# Altium project KitKTS.PrjPcb (part 2 of 3)

## Sheet 08-NANDStatusLed.SchDoc
size A4
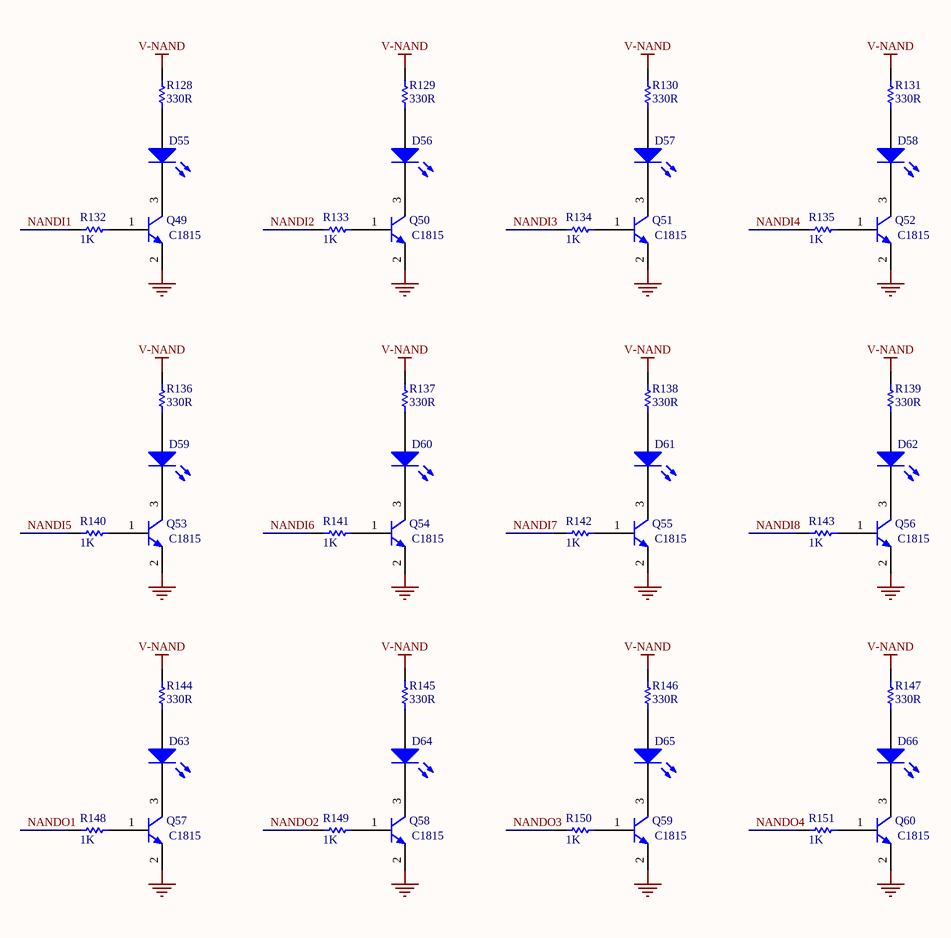
[diagram p13: 08-NANDStatusLed.SchDoc]

### Parts
D55  LED  [LED-3528]  (value not drawn)
D56  LED  [LED-3528]  (value not drawn)
D57  LED  [LED-3528]  (value not drawn)
D58  LED  [LED-3528]  (value not drawn)
D59  LED  [LED-3528]  (value not drawn)
D60  LED  [LED-3528]  (value not drawn)
D61  LED  [LED-3528]  (value not drawn)
D62  LED  [LED-3528]  (value not drawn)
D63  LED  [LED-3528]  (value not drawn)
D64  LED  [LED-3528]  (value not drawn)
D65  LED  [LED-3528]  (value not drawn)
D66  LED  [LED-3528]  (value not drawn)
Q49  value C1815  [SOT23-321]  (hidden comment: C1815-SMD)
Q50  value C1815  [SOT23-321]  (hidden comment: C1815-SMD)
Q51  value C1815  [SOT23-321]  (hidden comment: C1815-SMD)
Q52  value C1815  [SOT23-321]  (hidden comment: C1815-SMD)
Q53  value C1815  [SOT23-321]  (hidden comment: C1815-SMD)
Q54  value C1815  [SOT23-321]  (hidden comment: C1815-SMD)
Q55  value C1815  [SOT23-321]  (hidden comment: C1815-SMD)
Q56  value C1815  [SOT23-321]  (hidden comment: C1815-SMD)
Q57  value C1815  [SOT23-321]  (hidden comment: C1815-SMD)
Q58  value C1815  [SOT23-321]  (hidden comment: C1815-SMD)
Q59  value C1815  [SOT23-321]  (hidden comment: C1815-SMD)
Q60  value C1815  [SOT23-321]  (hidden comment: C1815-SMD)
R128  330R  [R-0805]
R129  330R  [R-0805]
R130  330R  [R-0805]
R131  330R  [R-0805]
R132  1K  [R-0805]
R133  1K  [R-0805]
R134  1K  [R-0805]
R135  1K  [R-0805]
R136  330R  [R-0805]
R137  330R  [R-0805]
R138  330R  [R-0805]
R139  330R  [R-0805]
R140  1K  [R-0805]
R141  1K  [R-0805]
R142  1K  [R-0805]
R143  1K  [R-0805]
R144  330R  [R-0805]
R145  330R  [R-0805]
R146  330R  [R-0805]
R147  330R  [R-0805]
R148  1K  [R-0805]
R149  1K  [R-0805]
R150  1K  [R-0805]
R151  1K  [R-0805]

### Nets
GND: Q49.2(E) Q50.2(E) Q51.2(E) Q52.2(E) Q53.2(E) Q54.2(E) Q55.2(E) Q56.2(E) Q57.2(E) Q58.2(E) Q59.2(E) Q60.2(E)
V-NAND: R128.2 R129.2 R130.2 R131.2 R136.2 R137.2 R138.2 R139.2 R144.2 R145.2 R146.2 R147.2
NANDI1: R132.2
NANDI2: R133.2
NANDI3: R134.2
NANDI4: R135.2
NANDI5: R140.2
NANDI6: R141.2
NANDI7: R142.2
NANDI8: R143.2
NANDO1: R148.2
NANDO2: R149.2
NANDO3: R150.2
NANDO4: R151.2
NetD55_1: D55.1(A) R128.1
NetD55_2: D55.2(K) Q49.3(C)
NetD56_1: D56.1(A) R129.1
NetD56_2: D56.2(K) Q50.3(C)
NetD57_1: D57.1(A) R130.1
NetD57_2: D57.2(K) Q51.3(C)
NetD58_1: D58.1(A) R131.1
NetD58_2: D58.2(K) Q52.3(C)
NetD59_1: D59.1(A) R136.1
NetD59_2: D59.2(K) Q53.3(C)
NetD60_1: D60.1(A) R137.1
NetD60_2: D60.2(K) Q54.3(C)
NetD61_1: D61.1(A) R138.1
NetD61_2: D61.2(K) Q55.3(C)
NetD62_1: D62.1(A) R139.1
NetD62_2: D62.2(K) Q56.3(C)
NetD63_1: D63.1(A) R144.1
NetD63_2: D63.2(K) Q57.3(C)
NetD64_1: D64.1(A) R145.1
NetD64_2: D64.2(K) Q58.3(C)
NetD65_1: D65.1(A) R146.1
NetD65_2: D65.2(K) Q59.3(C)
NetD66_1: D66.1(A) R147.1
NetD66_2: D66.2(K) Q60.3(C)
NetQ49_1: Q49.1(B) R132.1
NetQ50_1: Q50.1(B) R133.1
NetQ51_1: Q51.1(B) R134.1
NetQ52_1: Q52.1(B) R135.1
NetQ53_1: Q53.1(B) R140.1
NetQ54_1: Q54.1(B) R141.1
NetQ55_1: Q55.1(B) R142.1
NetQ56_1: Q56.1(B) R143.1
NetQ57_1: Q57.1(B) R148.1
NetQ58_1: Q58.1(B) R149.1
NetQ59_1: Q59.1(B) R150.1
NetQ60_1: Q60.1(B) R151.1

### Library data of the parts
D55-D66 = LED2: as D7 on sheet 04-ANDStatusLed; Published: 8-Jun-2000; LatestRevisionDate: 17-Jul-2002; LatestRevisionNote: Re-released for DXP Platform.; PackageVersion: Feb-2002; PackageReference: 3.2X1.6X1.1; Publisher: Altium Limited; PackageDescription: SM LED; 2 Flat Leads
Q49-Q60 = NPN: NPN Bipolar Transistor; Published: 8-Jun-2000; LatestRevisionDate: 17-Jul-2002; LatestRevisionNote: Re-released for DXP Platform.; PackageReference: TO-226-AA; PackageDescription: TO, Flat Index; 3 In-Line, Axial Leads; Body Dia. 4.8mm; Leads 0.55 x 0.51 mm (max); Code_JEDEC: TO-226-AA
R128-R151 = Res1: Resistor; Published: 8-Jun-2000; LatestRevisionDate: 17-Jul-2002; LatestRevisionNote: Re-released for DXP Platform.; PackageReference: AXIAL-0.3; Publisher: Altium Limited; PackageDescription: Axial Device, Thru-Hole; 2 Leads; 0.3 in Pin Spacing
  R128-R131 R136-R139 R144-R147: Value: 330R
  R132-R135 R140-R143 R148-R151: Value: 1K

## Sheet 09-LogicNOR.SchDoc
size A4
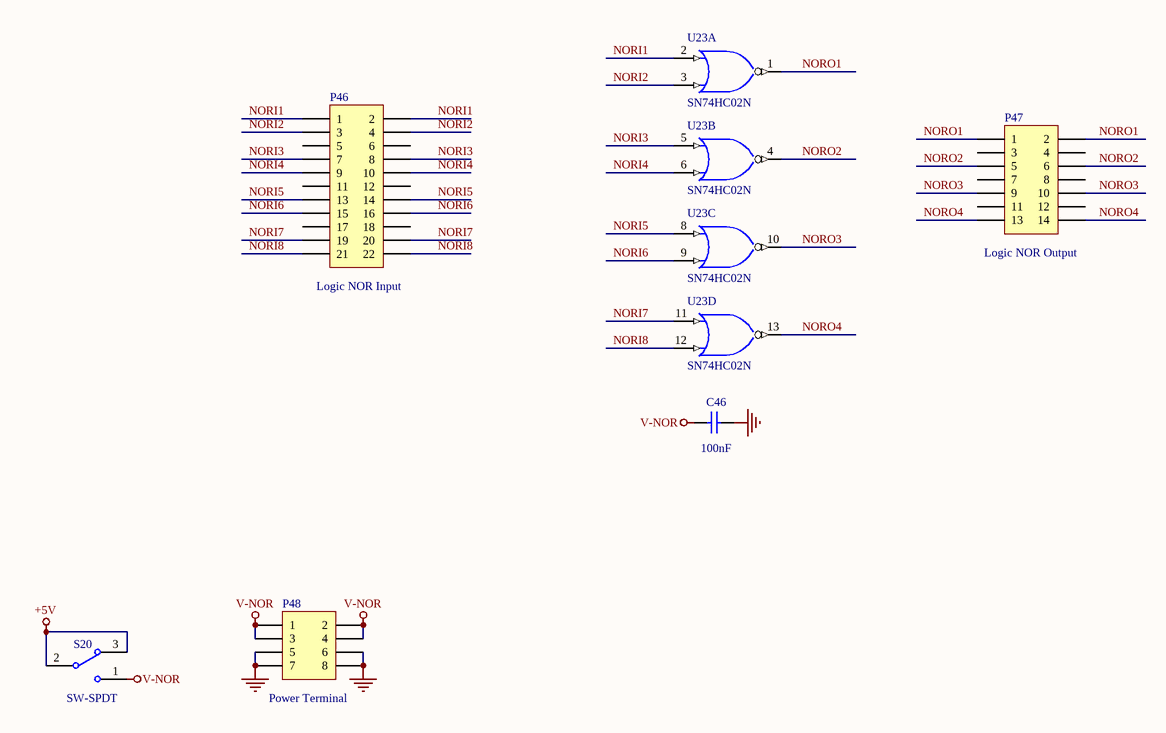
[diagram p14: 09-LogicNOR.SchDoc]

### Parts
C46  value 100nF  [C-0805]  (hidden comment: 104)
P46  value Logic NOR Input  [HDR2X11]  (hidden comment: Header 11X2)
P47  value Logic NOR Output  [HDR2X7]  (hidden comment: H7X2)
P48  Publisher: Power Terminal  [HDR2X4]  (hidden comment: Header 4X2)
S20  SW-SPDT  [SW-DIP1SMD]
U23  SN74HC02N  [SK-DIP14-300]  (parts A,B,C,D of 4)

### Nets
+5V: S20.2 S20.3
GND: C46.2 P48.5 P48.6 P48.7 P48.8 U23.7(GND)
V-NOR: C46.1 P48.1 P48.2 P48.3 P48.4 S20.1
VCC: U23.14(V-NOR)
NORI1: P46.1 P46.2 U23.2(A)
NORI2: P46.3 P46.4 U23.3(B)
NORI3: P46.7 P46.8 U23.5(A)
NORI4: P46.9 P46.10 U23.6(B)
NORI5: P46.13 P46.14 U23.8(A)
NORI6: P46.15 P46.16 U23.9(B)
NORI7: P46.19 P46.20 U23.11(A)
NORI8: P46.21 P46.22 U23.12(B)
NORO1: P47.1 P47.2 U23.1(Y)
NORO2: P47.5 P47.6 U23.4(Y)
NORO3: P47.9 P47.10 U23.10(Y)
NORO4: P47.13 P47.14 U23.13(Y)

Not connected (* = marked no-connect by the designer): P46 5 6 11 12 17 18; P47 3 4 7 8 11 12

### Library data of the parts
C46 = Cap: Capacitor; Published: 8-Jun-2000; LatestRevisionDate: 17-Jul-2002; LatestRevisionNote: Re-released for DXP Platform.; PackageReference: RAD-0.3; Publisher: Altium Limited; PackageDescription: Radial Cap, Thru-Hole; 2 Leads; 0.3 in Pin Spacing
P46 = Header 11X2: Header, 11-Pin, Dual row; LatestRevisionDate: 17-Jul-2002; LatestRevisionNote: Re-released for DXP Platform.
P47 = Header 7X2: Header, 7-Pin, Dual row; LatestRevisionDate: 17-Jul-2002; LatestRevisionNote: Re-released for DXP Platform.
P48 = Header 4X2: Header, 4-Pin, Dual row; LatestRevisionDate: 17-Jul-2002; LatestRevisionNote: Re-released for DXP Platform.
S20 = SW-SPDT: as S10 on sheet 02-PowerSupply; Published: 24-Mar-1999; LatestRevisionDate: 17-Dec-2003; LatestRevisionNote: Schematic revised, PCB Footprint replaced.; DatasheetVersion: 05-Dec-2000; PackageReference: TL36WW15050; Publisher: Altium Limited; PackageDescription: Switch; 4 Leads; ComponentLink1Description: Manufacturer Link; ComponentLink1URL: http://www.apem.com
U23 = SN74HC02N: Quadruple 2-Input Positive-NOR Gate; Published: 8-Jun-2000; LatestRevisionDate: 04-Mar-2005; LatestRevisionNote: Stylized 3D Model Added.; DatasheetVersion: May-1997; PackageVersion: Oct-1995; PackageReference: N014; Publisher: Altium Limited; PackageDescription: DIP; 14 Leads; Row Spacing 7.62 mm; Pitch 2.54 mm; ComponentLink1Description: Manufacturer Link; ComponentLink1URL: http://www.ti.com/; ComponentLink2Description: Datasheet; ComponentLink2URL: http://www-s.ti.com/sc/ds/sn74hc02.pdf

## Sheet 09-NORStatusLed.SchDoc
size A4
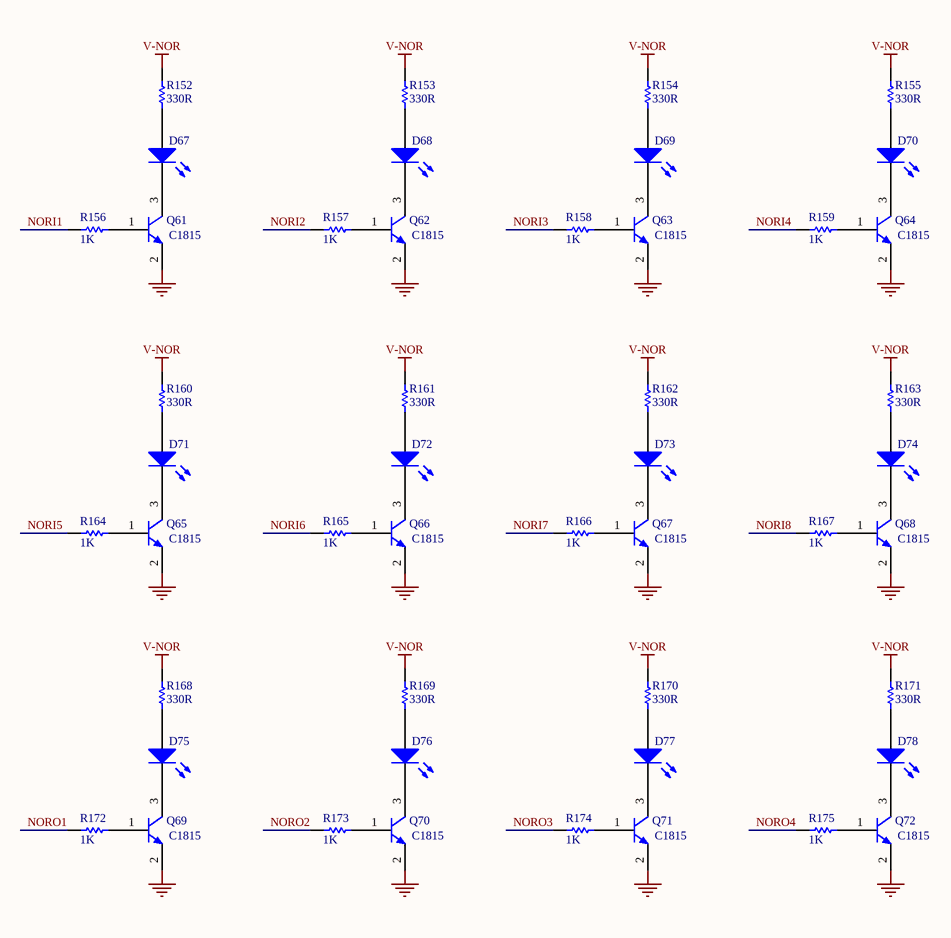
[diagram p15: 09-NORStatusLed.SchDoc]

### Parts
D67  LED  [LED-3528]  (value not drawn)
D68  LED  [LED-3528]  (value not drawn)
D69  LED  [LED-3528]  (value not drawn)
D70  LED  [LED-3528]  (value not drawn)
D71  LED  [LED-3528]  (value not drawn)
D72  LED  [LED-3528]  (value not drawn)
D73  LED  [LED-3528]  (value not drawn)
D74  LED  [LED-3528]  (value not drawn)
D75  LED  [LED-3528]  (value not drawn)
D76  LED  [LED-3528]  (value not drawn)
D77  LED  [LED-3528]  (value not drawn)
D78  LED  [LED-3528]  (value not drawn)
Q61  value C1815  [SOT23-321]  (hidden comment: C1815-SMD)
Q62  value C1815  [SOT23-321]  (hidden comment: C1815-SMD)
Q63  value C1815  [SOT23-321]  (hidden comment: C1815-SMD)
Q64  value C1815  [SOT23-321]  (hidden comment: C1815-SMD)
Q65  value C1815  [SOT23-321]  (hidden comment: C1815-SMD)
Q66  value C1815  [SOT23-321]  (hidden comment: C1815-SMD)
Q67  value C1815  [SOT23-321]  (hidden comment: C1815-SMD)
Q68  value C1815  [SOT23-321]  (hidden comment: C1815-SMD)
Q69  value C1815  [SOT23-321]  (hidden comment: C1815-SMD)
Q70  value C1815  [SOT23-321]  (hidden comment: C1815-SMD)
Q71  value C1815  [SOT23-321]  (hidden comment: C1815-SMD)
Q72  value C1815  [SOT23-321]  (hidden comment: C1815-SMD)
R152  330R  [R-0805]
R153  330R  [R-0805]
R154  330R  [R-0805]
R155  330R  [R-0805]
R156  1K  [R-0805]
R157  1K  [R-0805]
R158  1K  [R-0805]
R159  1K  [R-0805]
R160  330R  [R-0805]
R161  330R  [R-0805]
R162  330R  [R-0805]
R163  330R  [R-0805]
R164  1K  [R-0805]
R165  1K  [R-0805]
R166  1K  [R-0805]
R167  1K  [R-0805]
R168  330R  [R-0805]
R169  330R  [R-0805]
R170  330R  [R-0805]
R171  330R  [R-0805]
R172  1K  [R-0805]
R173  1K  [R-0805]
R174  1K  [R-0805]
R175  1K  [R-0805]

### Nets
GND: Q61.2(E) Q62.2(E) Q63.2(E) Q64.2(E) Q65.2(E) Q66.2(E) Q67.2(E) Q68.2(E) Q69.2(E) Q70.2(E) Q71.2(E) Q72.2(E)
V-NOR: R152.2 R153.2 R154.2 R155.2 R160.2 R161.2 R162.2 R163.2 R168.2 R169.2 R170.2 R171.2
NORI1: R156.2
NORI2: R157.2
NORI3: R158.2
NORI4: R159.2
NORI5: R164.2
NORI6: R165.2
NORI7: R166.2
NORI8: R167.2
NORO1: R172.2
NORO2: R173.2
NORO3: R174.2
NORO4: R175.2
NetD67_1: D67.1(A) R152.1
NetD67_2: D67.2(K) Q61.3(C)
NetD68_1: D68.1(A) R153.1
NetD68_2: D68.2(K) Q62.3(C)
NetD69_1: D69.1(A) R154.1
NetD69_2: D69.2(K) Q63.3(C)
NetD70_1: D70.1(A) R155.1
NetD70_2: D70.2(K) Q64.3(C)
NetD71_1: D71.1(A) R160.1
NetD71_2: D71.2(K) Q65.3(C)
NetD72_1: D72.1(A) R161.1
NetD72_2: D72.2(K) Q66.3(C)
NetD73_1: D73.1(A) R162.1
NetD73_2: D73.2(K) Q67.3(C)
NetD74_1: D74.1(A) R163.1
NetD74_2: D74.2(K) Q68.3(C)
NetD75_1: D75.1(A) R168.1
NetD75_2: D75.2(K) Q69.3(C)
NetD76_1: D76.1(A) R169.1
NetD76_2: D76.2(K) Q70.3(C)
NetD77_1: D77.1(A) R170.1
NetD77_2: D77.2(K) Q71.3(C)
NetD78_1: D78.1(A) R171.1
NetD78_2: D78.2(K) Q72.3(C)
NetQ61_1: Q61.1(B) R156.1
NetQ62_1: Q62.1(B) R157.1
NetQ63_1: Q63.1(B) R158.1
NetQ64_1: Q64.1(B) R159.1
NetQ65_1: Q65.1(B) R164.1
NetQ66_1: Q66.1(B) R165.1
NetQ67_1: Q67.1(B) R166.1
NetQ68_1: Q68.1(B) R167.1
NetQ69_1: Q69.1(B) R172.1
NetQ70_1: Q70.1(B) R173.1
NetQ71_1: Q71.1(B) R174.1
NetQ72_1: Q72.1(B) R175.1

### Library data of the parts
D67-D78 = LED2: as D7 on sheet 04-ANDStatusLed; Published: 8-Jun-2000; LatestRevisionDate: 17-Jul-2002; LatestRevisionNote: Re-released for DXP Platform.; PackageVersion: Feb-2002; PackageReference: 3.2X1.6X1.1; Publisher: Altium Limited; PackageDescription: SM LED; 2 Flat Leads
Q61-Q72 = NPN: NPN Bipolar Transistor; Published: 8-Jun-2000; LatestRevisionDate: 17-Jul-2002; LatestRevisionNote: Re-released for DXP Platform.; PackageReference: TO-226-AA; PackageDescription: TO, Flat Index; 3 In-Line, Axial Leads; Body Dia. 4.8mm; Leads 0.55 x 0.51 mm (max); Code_JEDEC: TO-226-AA
R152-R175 = Res1: Resistor; Published: 8-Jun-2000; LatestRevisionDate: 17-Jul-2002; LatestRevisionNote: Re-released for DXP Platform.; PackageReference: AXIAL-0.3; Publisher: Altium Limited; PackageDescription: Axial Device, Thru-Hole; 2 Leads; 0.3 in Pin Spacing
  R152-R155 R160-R163 R168-R171: Value: 330R
  R156-R159 R164-R167 R172-R175: Value: 1K

## Sheet 10-Buffer.SchDoc
size A4
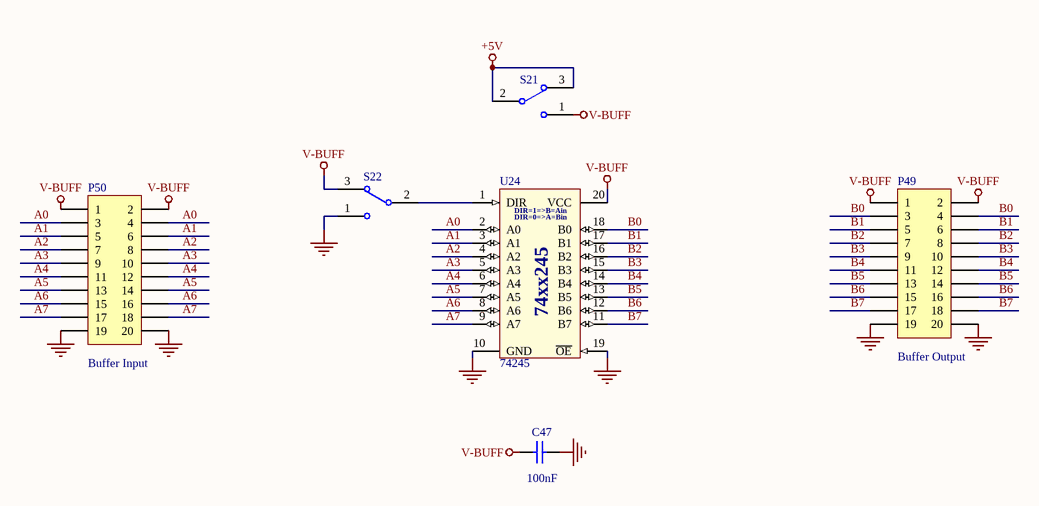
[diagram p16: 10-Buffer.SchDoc]

### Parts
C47  value 100nF  [C-0805]  (hidden comment: 104)
P49  value Buffer Output  [HDR2X10]  (hidden comment: H10X2)
P50  value Buffer Input  [HDR2X10]  (hidden comment: H10X2)
S21  SW-SPDT  [SW-DIP1SMD]  (value not drawn)
S22  SW-SPDT  [SW-DIP1SMD]  (value not drawn)
U24  74245  [DIP20/W0.3]

### Nets
+5V: S21.2 S21.3
GND: C47.2 P49.19 P49.20 P50.19 P50.20 S22.1 U24.10(GND) U24.19(~{OE})
V-BUFF: C47.1 P49.1 P49.2 P50.1 P50.2 S21.1 S22.3 U24.20(VCC)
A0: P50.3 P50.4 U24.2(A0)
A1: P50.5 P50.6 U24.3(A1)
A2: P50.7 P50.8 U24.4(A2)
A3: P50.9 P50.10 U24.5(A3)
A4: P50.11 P50.12 U24.6(A4)
A5: P50.13 P50.14 U24.7(A5)
A6: P50.15 P50.16 U24.8(A6)
A7: P50.17 P50.18 U24.9(A7)
B0: P49.3 P49.4 U24.18(B0)
B1: P49.5 P49.6 U24.17(B1)
B2: P49.7 P49.8 U24.16(B2)
B3: P49.9 P49.10 U24.15(B3)
B4: P49.11 P49.12 U24.14(B4)
B5: P49.13 P49.14 U24.13(B5)
B6: P49.15 P49.16 U24.12(B6)
B7: P49.17 P49.18 U24.11(B7)
NetS22_2: S22.2 U24.1(DIR)

### Notes on the sheet
- (in symbol 74245) DIR=1=>B=Ain; DIR=0=>A=Bin; 74xx245

### Library data of the parts
C47 = Cap: Capacitor; Published: 8-Jun-2000; LatestRevisionDate: 17-Jul-2002; LatestRevisionNote: Re-released for DXP Platform.; PackageReference: RAD-0.3; Publisher: Altium Limited; PackageDescription: Radial Cap, Thru-Hole; 2 Leads; 0.3 in Pin Spacing
P49 P50 = Header 10X2: Header, 10-Pin, Dual row; LatestRevisionDate: 17-Jul-2002; LatestRevisionNote: Re-released for DXP Platform.
S21 S22 = SW-SPDT: as S10 on sheet 02-PowerSupply; Published: 24-Mar-1999; LatestRevisionDate: 17-Dec-2003; LatestRevisionNote: Schematic revised, PCB Footprint replaced.; DatasheetVersion: 05-Dec-2000; PackageReference: TL36WW15050; Publisher: Altium Limited; PackageDescription: Switch; 4 Leads; ComponentLink1Description: Manufacturer Link; ComponentLink1URL: http://www.apem.com
U24 = 74245: Octal bus tranceiver; 3-state; Copyright by: VanDungEvn@gmail.com

## Sheet 11-DFlipFlop.SchDoc
size A4
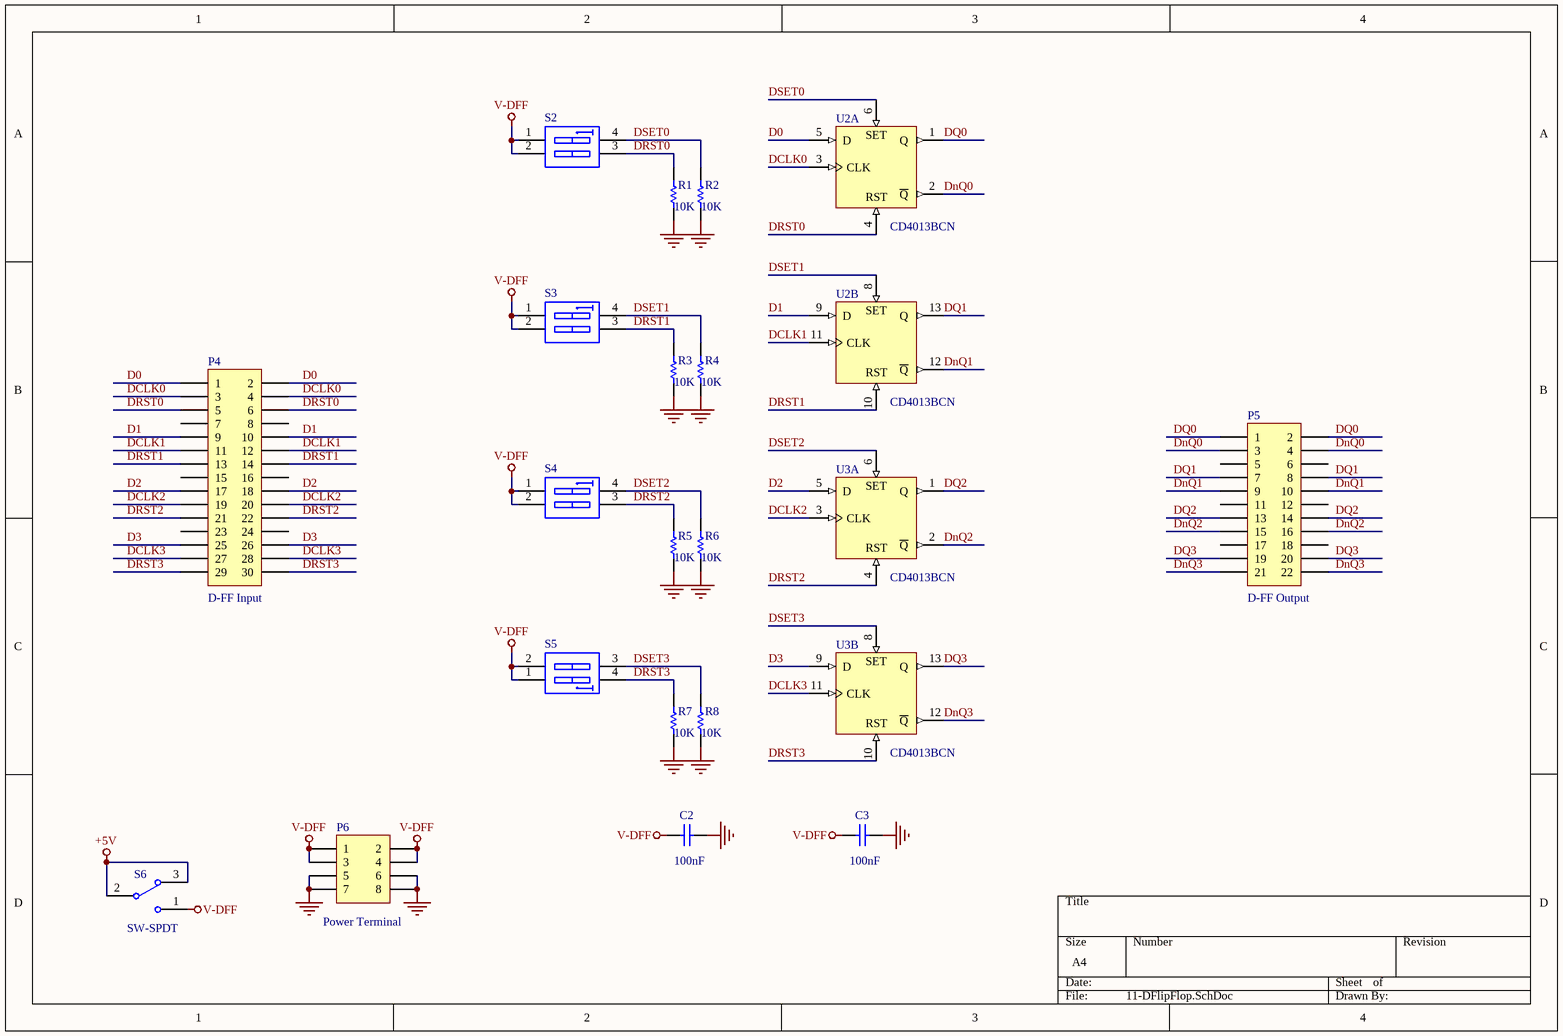
[diagram p17: 11-DFlipFlop.SchDoc]

### Parts
C2  value 100nF  [C-0805]  (hidden comment: 104)
C3  value 100nF  [C-0805]  (hidden comment: 104)
P4  value D-FF Input  [HDR2X15]  (hidden comment: Header 15X2)
P5  value D-FF Output  [HDR2X11]  (hidden comment: Header 11X2)
P6  Publisher: Power Terminal  [HDR2X4]  (hidden comment: Header 4X2)
R1  10K  [r-0805]
R2  10K  [r-0805]
R3  10K  [r-0805]
R4  10K  [r-0805]
R5  10K  [r-0805]
R6  10K  [r-0805]
R7  10K  [r-0805]
R8  10K  [r-0805]
S2  SW DIP-2  [sw-dip2]  (value not drawn)
S3  SW DIP-2  [sw-dip2]  (value not drawn)
S4  SW DIP-2  [sw-dip2]  (value not drawn)
S5  SW DIP-2  [sw-dip2]  (value not drawn)
S6  SW-SPDT  [SW-DIP1SMD]
U2  CD4013BCN  [SK-DIP14-300]  (parts A,B of 2)
U3  CD4013BCN  [SK-DIP14-300]  (parts A,B of 2)

### Nets
+5V: S6.2 S6.3
GND: C2.2 C3.2 P6.5 P6.6 P6.7 P6.8 R1.1 R2.1 R3.1 R4.1 R5.1 R6.1 R7.1 R8.1 U2.7(GND) U3.7(GND)
V-DFF: C2.1 C3.1 P6.1 P6.2 P6.3 P6.4 S2.1(A1) S2.2(A2) S3.1(A1) S3.2(A2) S4.1(A1) S4.2(A2) S5.1(A1) S5.2(A2) S6.1
VDD: U2.14(V-DFF) U3.14(V-DFF)
D0: P4.1 P4.2 U2.5(D)
D1: P4.9 P4.10 U2.9(D)
D2: P4.17 P4.18 U3.5(D)
D3: P4.25 P4.26 U3.9(D)
DCLK0: P4.3 P4.4 U2.3(CLK)
DCLK1: P4.11 P4.12 U2.11(CLK)
DCLK2: P4.19 P4.20 U3.3(CLK)
DCLK3: P4.27 P4.28 U3.11(CLK)
DnQ0: P5.3 P5.4 U2.2(~{Q})
DnQ1: P5.9 P5.10 U2.12(~{Q})
DnQ2: P5.15 P5.16 U3.2(~{Q})
DnQ3: P5.21 P5.22 U3.12(~{Q})
DQ0: P5.1 P5.2 U2.1(Q)
DQ1: P5.7 P5.8 U2.13(Q)
DQ2: P5.13 P5.14 U3.1(Q)
DQ3: P5.19 P5.20 U3.13(Q)
DRST0: P4.5 P4.6 R1.2 S2.3(B2) U2.4(RST)
DRST1: P4.13 P4.14 R3.2 S3.3(B2) U2.10(RST)
DRST2: P4.21 P4.22 R5.2 S4.3(B2) U3.4(RST)
DRST3: P4.29 P4.30 R7.2 S5.4(B1) U3.10(RST)
DSET0: R2.2 S2.4(B1) U2.6(S)
DSET1: R4.2 S3.4(B1) U2.8(S)
DSET2: R6.2 S4.4(B1) U3.6(S)
DSET3: R8.2 S5.3(B2) U3.8(S)

Not connected (* = marked no-connect by the designer): P4 7 8 15 16 23 24; P5 5 6 11 12 17 18

### Notes on the sheet
- (in symbol CD4013BCN, part A) SET
- (in symbol CD4013BCN, part B) SET

### Library data of the parts
C2 C3 = Cap: Capacitor; Published: 8-Jun-2000; LatestRevisionDate: 17-Jul-2002; LatestRevisionNote: Re-released for DXP Platform.; PackageReference: RAD-0.3; Publisher: Altium Limited; PackageDescription: Radial Cap, Thru-Hole; 2 Leads; 0.3 in Pin Spacing
P4 = Header 15X2: Header, 15-Pin, Dual row; LatestRevisionDate: 17-Jul-2002; LatestRevisionNote: Re-released for DXP Platform.
P5 = Header 11X2: Header, 11-Pin, Dual row; LatestRevisionDate: 17-Jul-2002; LatestRevisionNote: Re-released for DXP Platform.
P6 = Header 4X2: Header, 4-Pin, Dual row; LatestRevisionDate: 17-Jul-2002; LatestRevisionNote: Re-released for DXP Platform.
R1-R8 = Res1: Resistor; Published: 8-Jun-2000; LatestRevisionDate: 17-Jul-2002; LatestRevisionNote: Re-released for DXP Platform.; PackageReference: AXIAL-0.3; Publisher: Altium Limited; PackageDescription: Axial Device, Thru-Hole; 2 Leads; 0.3 in Pin Spacing; Value: 10K
S2-S5 = SW DIP-2: DIP Switch, 2 Position, SPST; Published: 24-Mar-1999; LatestRevisionDate: 17-Jul-2002; LatestRevisionNote: Re-released for DXP Platform.; PackageReference: DIP-4; Publisher: Altium Limited
S6 = SW-SPDT: as S10 on sheet 02-PowerSupply; Published: 24-Mar-1999; LatestRevisionDate: 17-Dec-2003; LatestRevisionNote: Schematic revised, PCB Footprint replaced.; DatasheetVersion: 05-Dec-2000; PackageReference: TL36WW15050; Publisher: Altium Limited; PackageDescription: Switch; 4 Leads; ComponentLink1Description: Manufacturer Link; ComponentLink1URL: http://www.apem.com
U2 U3 = CD4013BCN: Dual D-Type Flip-Flop; Published: 17-Jul-2002; LatestRevisionDate: 29-May-2009; LatestRevisionNote: Component Body Added.; DatasheetVersion: Jan-1999; PackageVersion: 2000; PackageReference: N14A; Publisher: Altium Limited; PackageDescription: DIP, 14-Pin, Row Spacing 7.62 mm, Pitch 2.54 mm; ComponentLink1Description: Manufacturer Link; ComponentLink1URL: http://www.fairchildsemi.com/

## Sheet 12-JKFlipFlop.SchDoc
size A4
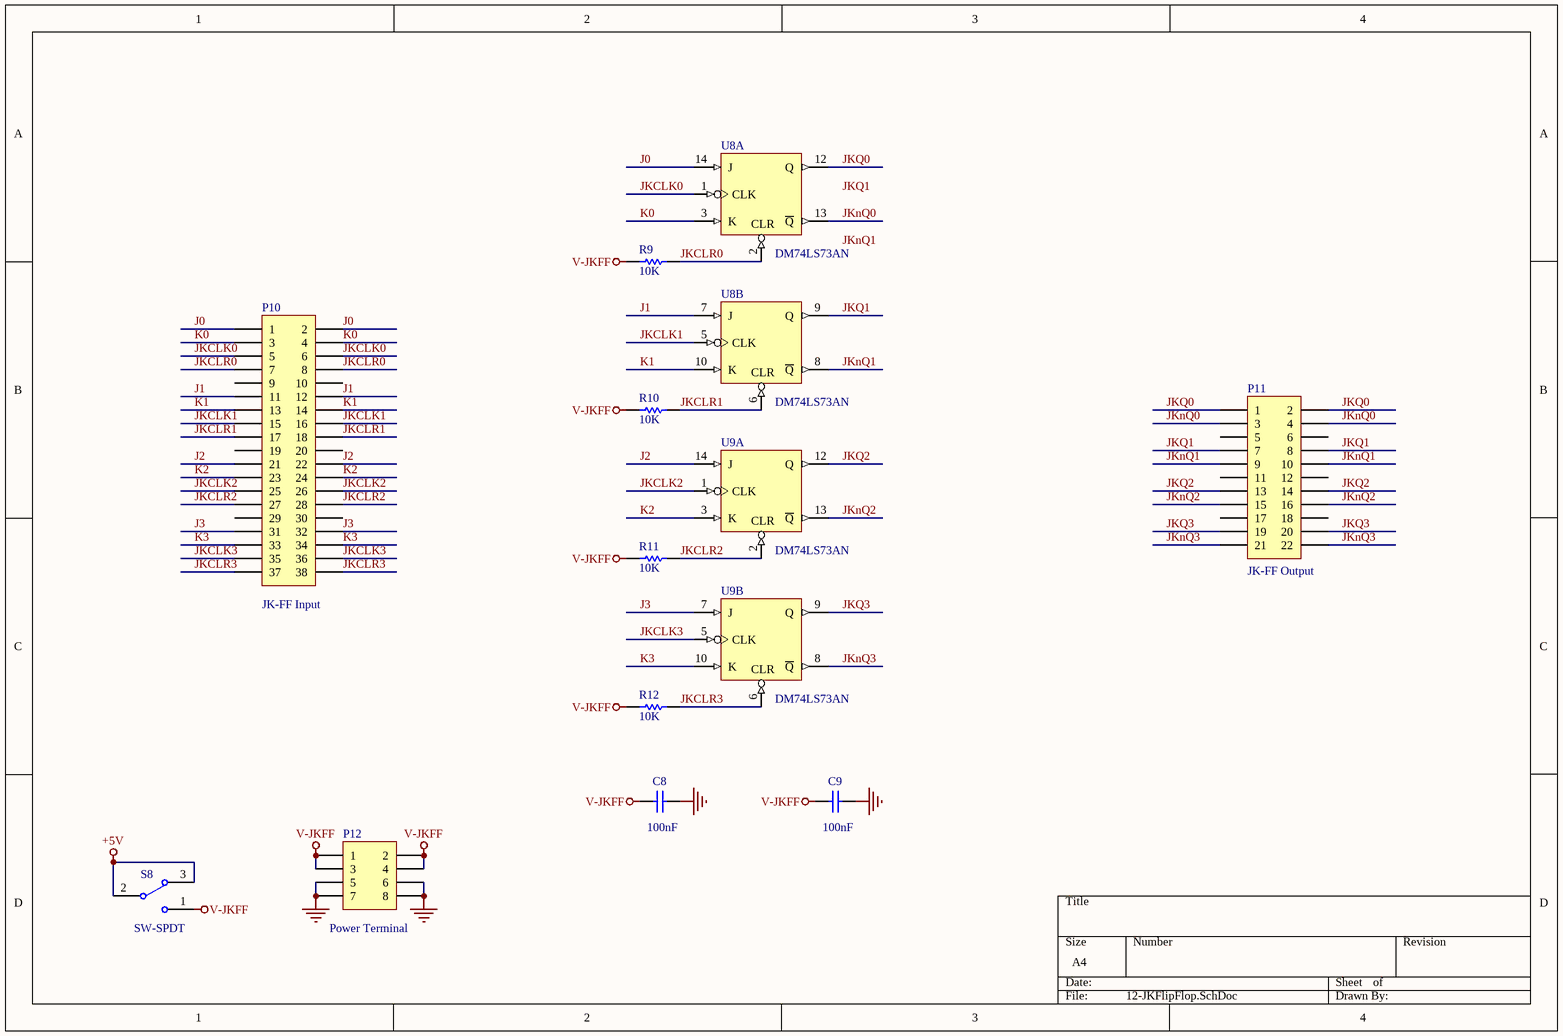
[diagram p18: 12-JKFlipFlop.SchDoc]

### Parts
C8  value 100nF  [c-0805]  (hidden comment: 104)
C9  value 100nF  [c-0805]  (hidden comment: 104)
P10  value JK-FF Input  [HDR2X19]  (hidden comment: Header 19X2)
P11  value JK-FF Output  [HDR2X11]  (hidden comment: Header 11X2)
P12  Publisher: Power Terminal  [HDR2X4]  (hidden comment: Header 4X2)
R9  10K  [r-0805]
R10  10K  [r-0805]
R11  10K  [r-0805]
R12  10K  [r-0805]
S8  SW-SPDT  [SW-DIP1SMD]
U8  DM74LS73AN  [SK-DIP14-300]  (parts A,B of 2)
U9  DM74LS73AN  [SK-DIP14-300]  (parts A,B of 2)

### Nets
+5V: S8.2 S8.3
GND: C8.2 C9.2 P12.5 P12.6 P12.7 P12.8 U8.11(GND) U9.11(GND)
V-JKFF: C8.1 C9.1 P12.1 P12.2 P12.3 P12.4 R9.2 R10.2 R11.2 R12.2 S8.1
VCC: U8.4(V-JKFF) U9.4(V-JKFF)
J0: P10.1 P10.2 U8.14(J)
J1: P10.11 P10.12 U8.7(J)
J2: P10.21 P10.22 U9.14(J)
J3: P10.31 P10.32 U9.7(J)
JKCLK0: P10.5 P10.6 U8.1(CLK)
JKCLK1: P10.15 P10.16 U8.5(CLK)
JKCLK2: P10.25 P10.26 U9.1(CLK)
JKCLK3: P10.35 P10.36 U9.5(CLK)
JKCLR0: P10.7 P10.8 R9.1 U8.2(CLR)
JKCLR1: P10.17 P10.18 R10.1 U8.6(CLR)
JKCLR2: P10.27 P10.28 R11.1 U9.2(CLR)
JKCLR3: P10.37 P10.38 R12.1 U9.6(CLR)
JKnQ0: P11.3 P11.4 U8.13(~{Q})
JKnQ1: P11.9 P11.10 U8.8(~{Q})
JKnQ2: P11.15 P11.16 U9.13(~{Q})
JKnQ3: P11.21 P11.22 U9.8(~{Q})
JKQ0: P11.1 P11.2 U8.12(Q)
JKQ1: P11.7 P11.8 U8.9(Q)
JKQ2: P11.13 P11.14 U9.12(Q)
JKQ3: P11.19 P11.20 U9.9(Q)
K0: P10.3 P10.4 U8.3(K)
K1: P10.13 P10.14 U8.10(K)
K2: P10.23 P10.24 U9.3(K)
K3: P10.33 P10.34 U9.10(K)

Not connected (* = marked no-connect by the designer): P10 9 10 19 20 29 30; P11 5 6 11 12 17 18

### Notes on the sheet
- Labels drawn without touching a wire or pin: JKnQ1, JKQ1

### Library data of the parts
C8 C9 = Cap: Capacitor; Published: 8-Jun-2000; LatestRevisionDate: 17-Jul-2002; LatestRevisionNote: Re-released for DXP Platform.; PackageReference: RAD-0.3; Publisher: Altium Limited; PackageDescription: Radial Cap, Thru-Hole; 2 Leads; 0.3 in Pin Spacing
P10 = Header 19X2: Header, 19-Pin, Dual row; LatestRevisionDate: 17-Jul-2002; LatestRevisionNote: Re-released for DXP Platform.
P11 = Header 11X2: Header, 11-Pin, Dual row; LatestRevisionDate: 17-Jul-2002; LatestRevisionNote: Re-released for DXP Platform.
P12 = Header 4X2: Header, 4-Pin, Dual row; LatestRevisionDate: 17-Jul-2002; LatestRevisionNote: Re-released for DXP Platform.
R9-R12 = Res1: Resistor; Published: 8-Jun-2000; LatestRevisionDate: 17-Jul-2002; LatestRevisionNote: Re-released for DXP Platform.; PackageReference: AXIAL-0.3; Publisher: Altium Limited; PackageDescription: Axial Device, Thru-Hole; 2 Leads; 0.3 in Pin Spacing; Value: 10K
S8 = SW-SPDT: as S10 on sheet 02-PowerSupply; Published: 24-Mar-1999; LatestRevisionDate: 17-Dec-2003; LatestRevisionNote: Schematic revised, PCB Footprint replaced.; DatasheetVersion: 05-Dec-2000; PackageReference: TL36WW15050; Publisher: Altium Limited; PackageDescription: Switch; 4 Leads; ComponentLink1Description: Manufacturer Link; ComponentLink1URL: http://www.apem.com
U8 U9 = DM74LS73AN: Dual Negative-Edge-Triggered Master-Slave J-K Flip-Flop with Clear and Complementary Output; Published: 17-Jul-2002; LatestRevisionDate: 29-May-2009; LatestRevisionNote: Component Body Added.; DatasheetVersion: Mar-1998; PackageVersion: 2000; PackageReference: N14A; Publisher: Altium Limited; PackageDescription: DIP, 14-Pin, Row Spacing 7.62 mm, Pitch 2.54 mm; ComponentLink1Description: Manufacturer Link; ComponentLink1URL: http://www.fairchildsemi.com/

## Sheet 13-Counter74LS90.SchDoc
size A4
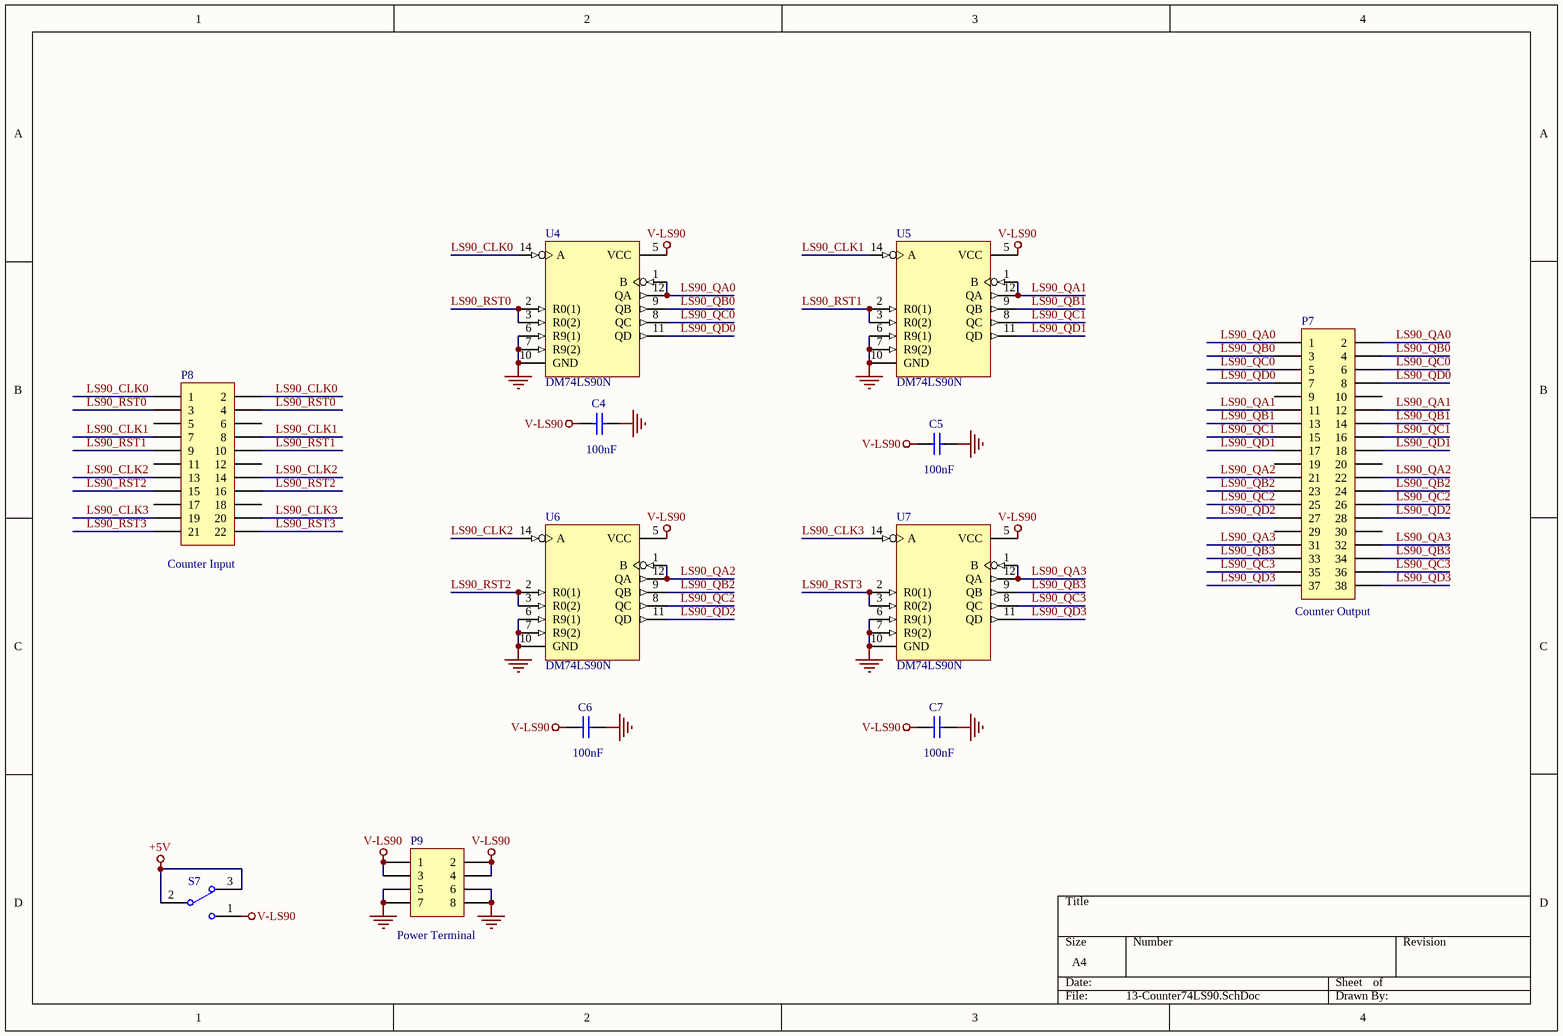
[diagram p19: 13-Counter74LS90.SchDoc]

### Parts
C4  value 100nF  [c-0805]  (hidden comment: 104)
C5  value 100nF  [c-0805]  (hidden comment: 104)
C6  value 100nF  [c-0805]  (hidden comment: 104)
C7  value 100nF  [c-0805]  (hidden comment: 104)
P7  value Counter Output  [HDR2X19]  (hidden comment: Header 19X2)
P8  value Counter Input  [HDR2X11]  (hidden comment: Header 11X2)
P9  Publisher: Power Terminal  [HDR2X4]  (hidden comment: Header 4X2)
S7  SW-SPDT  [SW-DIP1SMD]  (value not drawn)
U4  DM74LS90N  [SK-DIP14-300]
U5  DM74LS90N  [SK-DIP14-300]
U6  DM74LS90N  [SK-DIP14-300]
U7  DM74LS90N  [SK-DIP14-300]

### Nets
+5V: S7.2 S7.3
GND: C4.2 C5.2 C6.2 C7.2 P9.5 P9.6 P9.7 P9.8 U4.6(R9(1)) U4.7(R9(2)) U4.10(GND) U5.6(R9(1)) U5.7(R9(2)) U5.10(GND) U6.6(R9(1)) U6.7(R9(2)) U6.10(GND) U7.6(R9(1)) U7.7(R9(2)) U7.10(GND)
V-LS90: C4.1 C5.1 C6.1 C7.1 P9.1 P9.2 P9.3 P9.4 S7.1 U4.5(VCC) U5.5(VCC) U6.5(VCC) U7.5(VCC)
LS90_CLK0: P8.1 P8.2 U4.14(A)
LS90_CLK1: P8.7 P8.8 U5.14(A)
LS90_CLK2: P8.13 P8.14 U6.14(A)
LS90_CLK3: P8.19 P8.20 U7.14(A)
LS90_QA0: P7.1 P7.2 U4.1(B) U4.12(QA)
LS90_QA1: P7.11 P7.12 U5.1(B) U5.12(QA)
LS90_QA2: P7.21 P7.22 U6.1(B) U6.12(QA)
LS90_QA3: P7.31 P7.32 U7.1(B) U7.12(QA)
LS90_QB0: P7.3 P7.4 U4.9(QB)
LS90_QB1: P7.13 P7.14 U5.9(QB)
LS90_QB2: P7.23 P7.24 U6.9(QB)
LS90_QB3: P7.33 P7.34 U7.9(QB)
LS90_QC0: P7.5 P7.6 U4.8(QC)
LS90_QC1: P7.15 P7.16 U5.8(QC)
LS90_QC2: P7.25 P7.26 U6.8(QC)
LS90_QC3: P7.35 P7.36 U7.8(QC)
LS90_QD0: P7.7 P7.8 U4.11(QD)
LS90_QD1: P7.17 P7.18 U5.11(QD)
LS90_QD2: P7.27 P7.28 U6.11(QD)
LS90_QD3: P7.37 P7.38 U7.11(QD)
LS90_RST0: P8.3 P8.4 U4.2(R0(1)) U4.3(R0(2))
LS90_RST1: P8.9 P8.10 U5.2(R0(1)) U5.3(R0(2))
LS90_RST2: P8.15 P8.16 U6.2(R0(1)) U6.3(R0(2))
LS90_RST3: P8.21 P8.22 U7.2(R0(1)) U7.3(R0(2))

Not connected (* = marked no-connect by the designer): P7 9 10 19 20 29 30; P8 5 6 11 12 17 18

### Library data of the parts
C4-C7 = Cap: Capacitor; Published: 8-Jun-2000; LatestRevisionDate: 17-Jul-2002; LatestRevisionNote: Re-released for DXP Platform.; PackageReference: RAD-0.3; Publisher: Altium Limited; PackageDescription: Radial Cap, Thru-Hole; 2 Leads; 0.3 in Pin Spacing
P7 = Header 19X2: Header, 19-Pin, Dual row; LatestRevisionDate: 17-Jul-2002; LatestRevisionNote: Re-released for DXP Platform.
P8 = Header 11X2: Header, 11-Pin, Dual row; LatestRevisionDate: 17-Jul-2002; LatestRevisionNote: Re-released for DXP Platform.
P9 = Header 4X2: Header, 4-Pin, Dual row; LatestRevisionDate: 17-Jul-2002; LatestRevisionNote: Re-released for DXP Platform.
S7 = SW-SPDT: as S10 on sheet 02-PowerSupply; Published: 24-Mar-1999; LatestRevisionDate: 17-Dec-2003; LatestRevisionNote: Schematic revised, PCB Footprint replaced.; DatasheetVersion: 05-Dec-2000; PackageReference: TL36WW15050; Publisher: Altium Limited; PackageDescription: Switch; 4 Leads; ComponentLink1Description: Manufacturer Link; ComponentLink1URL: http://www.apem.com
U4-U7 = DM74LS90N: Decade and Binary Counter; Note: NC pins 4 and 13 are not drawn.; Published: 17-Jul-2002; LatestRevisionDate: 29-May-2009; LatestRevisionNote: Component Body Added.; DatasheetVersion: Mar-1998; PackageVersion: 2000; PackageReference: N14A; Publisher: Altium Limited; PackageDescription: DIP, 14-Pin, Row Spacing 7.62 mm, Pitch 2.54 mm; ComponentLink1Description: Manufacturer Link; ComponentLink1URL: http://www.fairchildsemi.com/

## Sheet 14-Counter74LS192.SchDoc
size A4
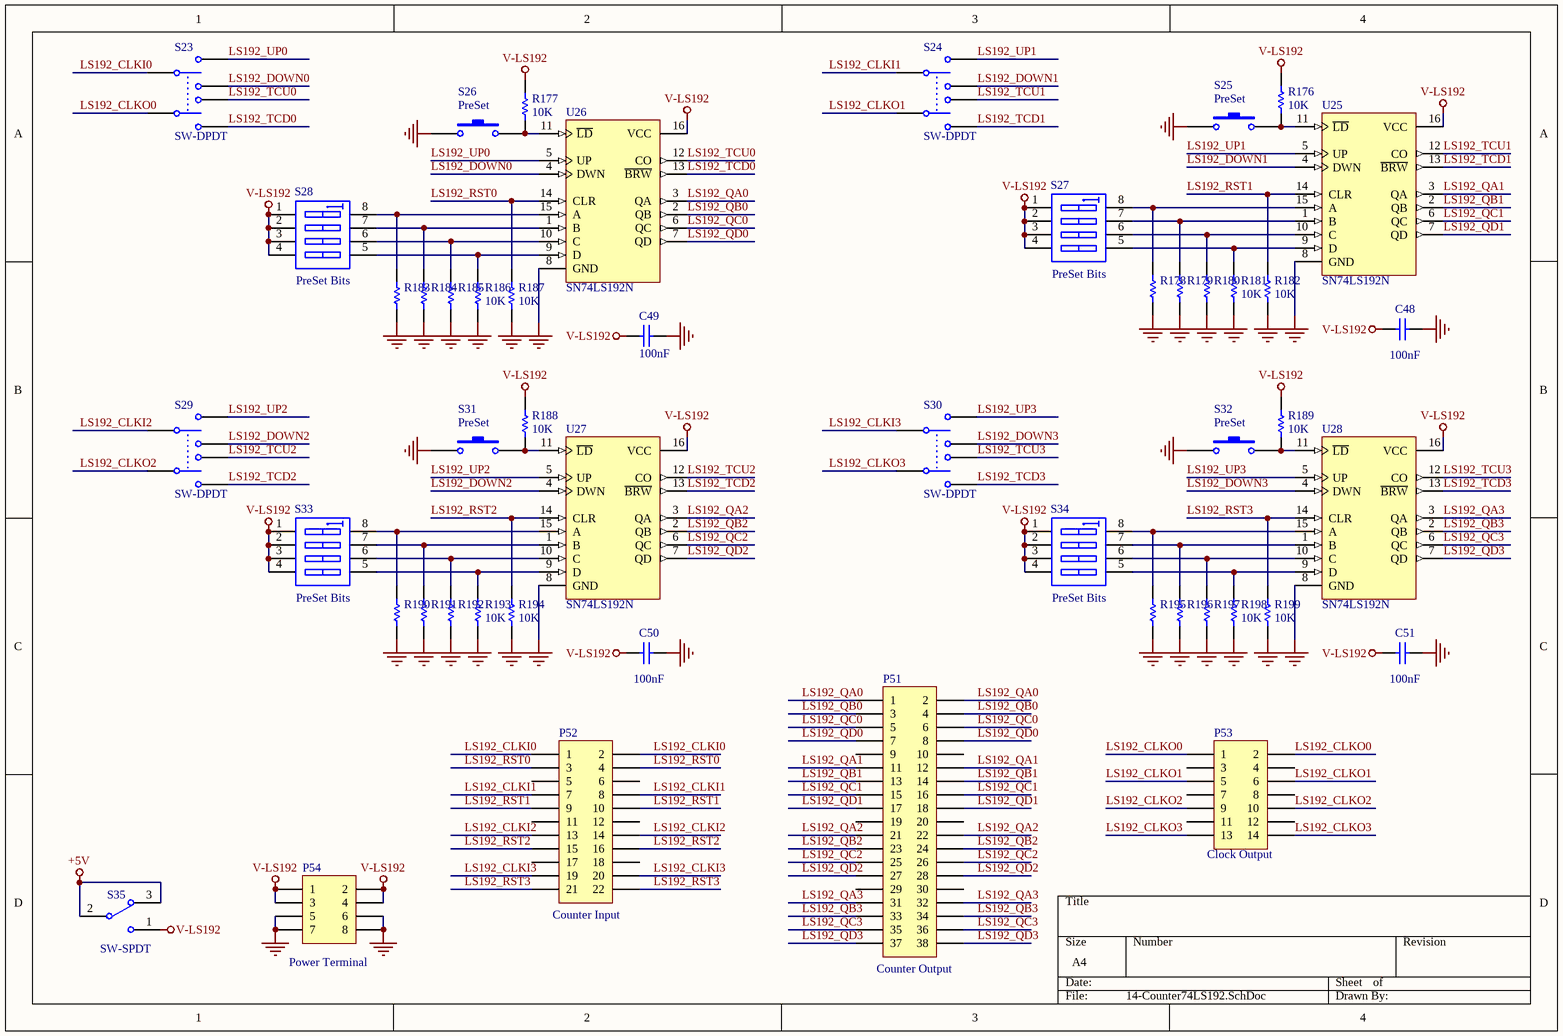
[diagram p20: 14-Counter74LS192.SchDoc]

### Parts
C48  value 100nF  [c-0805]  (hidden comment: 104)
C49  value 100nF  [c-0805]  (hidden comment: 104)
C50  value 100nF  [c-0805]  (hidden comment: 104)
C51  value 100nF  [c-0805]  (hidden comment: 104)
P51  value Counter Output  [HDR2X19]  (hidden comment: Header 19X2)
P52  value Counter Input  [HDR2X11]  (hidden comment: Header 11X2)
P53  value Clock Output  [HDR2X7]  (hidden comment: Header 7X2)
P54  Publisher: Power Terminal  [HDR2X4]  (hidden comment: Header 4X2)
R176  10K  [r-0805]
R177  10K  [r-0805]
R178  103  [r-0805]  (value not drawn)
R179  103  [r-0805]  (value not drawn)
R180  103  [r-0805]  (value not drawn)
R181  10K  [r-0805]
R182  10K  [r-0805]
R183  103  [r-0805]  (value not drawn)
R184  103  [r-0805]  (value not drawn)
R185  103  [r-0805]  (value not drawn)
R186  10K  [r-0805]
R187  10K  [r-0805]
R188  10K  [r-0805]
R189  10K  [r-0805]
R190  103  [r-0805]  (value not drawn)
R191  103  [r-0805]  (value not drawn)
R192  103  [r-0805]  (value not drawn)
R193  10K  [r-0805]
R194  10K  [r-0805]
R195  103  [r-0805]  (value not drawn)
R196  103  [r-0805]  (value not drawn)
R197  103  [r-0805]  (value not drawn)
R198  10K  [r-0805]
R199  10K  [r-0805]
S23  SW-DPDT  [DPDT-6]
S24  SW-DPDT  [DPDT-6]
S25  value PreSet  [SW2]  (hidden comment: SW-PB)
S26  value PreSet  [SW2]  (hidden comment: SW-PB)
S27  value PreSet Bits  [SW-DIP4]  (hidden comment: SW DIP-4)
S28  value PreSet Bits  [SW-DIP4]  (hidden comment: SW DIP-4)
S29  SW-DPDT  [DPDT-6]
S30  SW-DPDT  [DPDT-6]
S31  value PreSet  [SW2]  (hidden comment: SW-PB)
S32  value PreSet  [SW2]  (hidden comment: SW-PB)
S33  value PreSet Bits  [SW-DIP4]  (hidden comment: SW DIP-4)
S34  value PreSet Bits  [SW-DIP4]  (hidden comment: SW DIP-4)
S35  SW-SPDT  [SW-DIP1SMD]
U25  SN74LS192N  [DIP16]
U26  SN74LS192N  [DIP16]
U27  SN74LS192N  [DIP16]
U28  SN74LS192N  [DIP16]

### Nets
+5V: S35.2 S35.3
GND: C48.2 C49.2 C50.2 C51.2 P54.5 P54.6 P54.7 P54.8 R178.1 R179.1 R180.1 R181.1 R182.1 R183.1 R184.1 R185.1 R186.1 R187.1 R190.1 R191.1 R192.1 R193.1 R194.1 R195.1 R196.1 R197.1 R198.1 R199.1 S25.1 S26.1 S31.1 S32.1 U25.8(GND) U26.8(GND) U27.8(GND) U28.8(GND)
V-LS192: C48.1 C49.1 C50.1 C51.1 P54.1 P54.2 P54.3 P54.4 R176.2 R177.2 R188.2 R189.2 S27.1(A1) S27.2(A2) S27.3(A3) S27.4(A4) S28.1(A1) S28.2(A2) S28.3(A3) S28.4(A4) S33.1(A1) S33.2(A2) S33.3(A3) S33.4(A4) S34.1(A1) S34.2(A2) S34.3(A3) S34.4(A4) S35.1 U25.16(VCC) U26.16(VCC) U27.16(VCC) U28.16(VCC)
LS192_CLKI0: P52.1 P52.2 S23.1
LS192_CLKI1: P52.7 P52.8 S24.1
LS192_CLKI2: P52.13 P52.14 S29.1
LS192_CLKI3: P52.19 P52.20 S30.1
LS192_CLKO0: P53.1 P53.2 S23.4
LS192_CLKO1: P53.5 P53.6 S24.4
LS192_CLKO2: P53.9 P53.10 S29.4
LS192_CLKO3: P53.13 P53.14 S30.4
LS192_DOWN0: S23.3 U26.4(DWN)
LS192_DOWN1: S24.3 U25.4(DWN)
LS192_DOWN2: S29.3 U27.4(DWN)
LS192_DOWN3: S30.3 U28.4(DWN)
LS192_QA0: P51.1 P51.2 U26.3(QA)
LS192_QA1: P51.11 P51.12 U25.3(QA)
LS192_QA2: P51.21 P51.22 U27.3(QA)
LS192_QA3: P51.31 P51.32 U28.3(QA)
LS192_QB0: P51.3 P51.4 U26.2(QB)
LS192_QB1: P51.13 P51.14 U25.2(QB)
LS192_QB2: P51.23 P51.24 U27.2(QB)
LS192_QB3: P51.33 P51.34 U28.2(QB)
LS192_QC0: P51.5 P51.6 U26.6(QC)
LS192_QC1: P51.15 P51.16 U25.6(QC)
LS192_QC2: P51.25 P51.26 U27.6(QC)
LS192_QC3: P51.35 P51.36 U28.6(QC)
LS192_QD0: P51.7 P51.8 U26.7(QD)
LS192_QD1: P51.17 P51.18 U25.7(QD)
LS192_QD2: P51.27 P51.28 U27.7(QD)
LS192_QD3: P51.37 P51.38 U28.7(QD)
LS192_RST0: P52.3 P52.4 R187.2 U26.14(CLR)
LS192_RST1: P52.9 P52.10 R182.2 U25.14(CLR)
LS192_RST2: P52.15 P52.16 R194.2 U27.14(CLR)
LS192_RST3: P52.21 P52.22 R199.2 U28.14(CLR)
LS192_TCD0: S23.6 U26.13(~{BRW})
LS192_TCD1: S24.6 U25.13(~{BRW})
LS192_TCD2: S29.6 U27.13(~{BRW})
LS192_TCD3: S30.6 U28.13(~{BRW})
LS192_TCU0: S23.5 U26.12(CO)
LS192_TCU1: S24.5 U25.12(CO)
LS192_TCU2: S29.5 U27.12(CO)
LS192_TCU3: S30.5 U28.12(CO)
LS192_UP0: S23.2 U26.5(UP)
LS192_UP1: S24.2 U25.5(UP)
LS192_UP2: S29.2 U27.5(UP)
LS192_UP3: S30.2 U28.5(UP)
NetR176_1: R176.1 S25.2 U25.11(~{LD})
NetR177_1: R177.1 S26.2 U26.11(~{LD})
NetR178_2: R178.2 S27.8(B1) U25.15(A)
NetR179_2: R179.2 S27.7(B2) U25.1(B)
NetR180_2: R180.2 S27.6(B3) U25.10(C)
NetR181_2: R181.2 S27.5(B4) U25.9(D)
NetR183_2: R183.2 S28.8(B1) U26.15(A)
NetR184_2: R184.2 S28.7(B2) U26.1(B)
NetR185_2: R185.2 S28.6(B3) U26.10(C)
NetR186_2: R186.2 S28.5(B4) U26.9(D)
NetR188_1: R188.1 S31.2 U27.11(~{LD})
NetR189_1: R189.1 S32.2 U28.11(~{LD})
NetR190_2: R190.2 S33.8(B1) U27.15(A)
NetR191_2: R191.2 S33.7(B2) U27.1(B)
NetR192_2: R192.2 S33.6(B3) U27.10(C)
NetR193_2: R193.2 S33.5(B4) U27.9(D)
NetR195_2: R195.2 S34.8(B1) U28.15(A)
NetR196_2: R196.2 S34.7(B2) U28.1(B)
NetR197_2: R197.2 S34.6(B3) U28.10(C)
NetR198_2: R198.2 S34.5(B4) U28.9(D)

Not connected (* = marked no-connect by the designer): P51 9 10 19 20 29 30; P52 5 6 11 12 17 18; P53 3 4 7 8 11 12

### Library data of the parts
C48-C51 = Cap: Capacitor; Published: 8-Jun-2000; LatestRevisionDate: 17-Jul-2002; LatestRevisionNote: Re-released for DXP Platform.; PackageReference: RAD-0.3; Publisher: Altium Limited; PackageDescription: Radial Cap, Thru-Hole; 2 Leads; 0.3 in Pin Spacing
P51 = Header 19X2: Header, 19-Pin, Dual row; LatestRevisionDate: 17-Jul-2002; LatestRevisionNote: Re-released for DXP Platform.
P52 = Header 11X2: Header, 11-Pin, Dual row; LatestRevisionDate: 17-Jul-2002; LatestRevisionNote: Re-released for DXP Platform.
P53 = Header 7X2: Header, 7-Pin, Dual row; LatestRevisionDate: 17-Jul-2002; LatestRevisionNote: Re-released for DXP Platform.
P54 = Header 4X2: Header, 4-Pin, Dual row; LatestRevisionDate: 17-Jul-2002; LatestRevisionNote: Re-released for DXP Platform.
R176 R177 R181 R182 R186-R189 R193 R194 R198 R199 = Res1: Resistor; Published: 8-Jun-2000; LatestRevisionDate: 17-Jul-2002; LatestRevisionNote: Re-released for DXP Platform.; PackageReference: AXIAL-0.3; Publisher: Altium Limited; PackageDescription: Axial Device, Thru-Hole; 2 Leads; 0.3 in Pin Spacing; Value: 10K
R178-R180 R183-R185 R190-R192 R195-R197 = Res1: Resistor; Value: 10K; Published: 8-Jun-2000; LatestRevisionDate: 17-Jul-2002; LatestRevisionNote: Re-released for DXP Platform.; PackageReference: AXIAL-0.3; Publisher: Altium Limited; PackageDescription: Axial Device, Thru-Hole; 2 Leads; 0.3 in Pin Spacing
S23 S24 S29 S30 = SW-DPDT: Double-Pole, Double-Throw Switch; Published: 24-Mar-1999; LatestRevisionDate: 17-Jul-2002; LatestRevisionNote: Re-released for DXP Platform.; PackageReference: DPDT-6; Publisher: Altium Limited
S25 S26 S31 S32 = SW-PB: Switch; Published: 24-Mar-1999; LatestRevisionDate: 17-Jul-2002; LatestRevisionNote: Re-released for DXP Platform.; PackageReference: SPST-2
S27 S28 S33 S34 = SW DIP-4: DIP Switch, 4 Position, SPST; Published: 24-Mar-1999; LatestRevisionDate: 29-May-2009; LatestRevisionNote: IPC-7351 Footprint Added.; PackageVersion: Dec-2002; PackageReference: SO8; PackageDescription: 8-Pin Small Outline Integrated Circuit 1.27 mm Pitch; Code_JEDEC: MS-012-AA; Code_IPC: SOIC127P600-8
S35 = SW-SPDT: SPDT Subminiature Toggle Switch, Right Angle Mounting, Vertical Actuation; Published: 24-Mar-1999; LatestRevisionDate: 17-Dec-2003; LatestRevisionNote: Schematic revised, PCB Footprint replaced.; DatasheetVersion: 05-Dec-2000; PackageReference: TL36WW15050; Publisher: Altium Limited; PackageDescription: Switch; 4 Leads; ComponentLink1Description: Manufacturer Link; ComponentLink1URL: http://www.apem.com
U25-U28 = SN74LS192N: Synchronous 4-Bit Up/Down Counter (Dual Clock with Clear); ComponentAvailability: Obsolete; Published: 8-Jun-2000; LatestRevisionDate: 04-Mar-2005; LatestRevisionNote: Stylized 3D Model Added.; DatasheetVersion: Mar-1988; PackageVersion: Oct-1995; PackageReference: N016D; Publisher: Altium Limited; PackageDescription: DIP; 16 Leads; Row Spacing 7.62 mm; Pitch 2.54 mm; Code_JEDEC: MS-001-BB; ComponentLink1Description: Manufacturer Link; ComponentLink1URL: http://www.ti.com/; ComponentLink2Description: Datasheet; ComponentLink2URL: http://www-s.ti.com/sc/ds/sn74ls192.pdf

## Sheet 15-DistanceSRF05.SchDoc
size A4
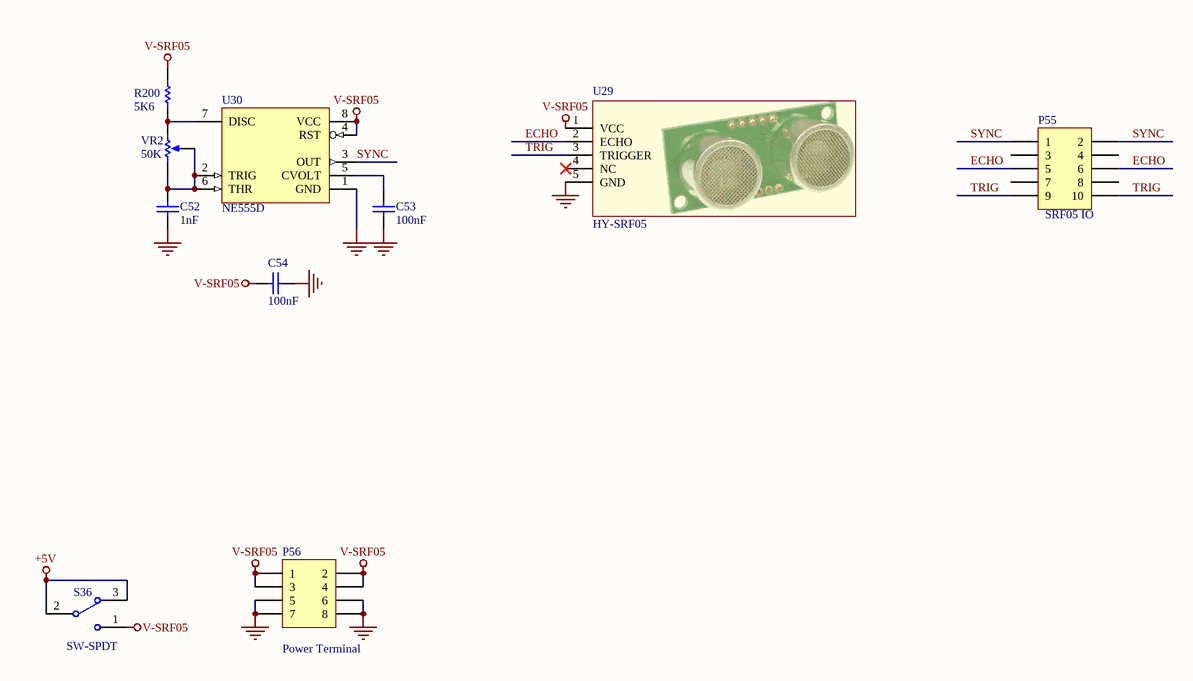
[diagram p21: 15-DistanceSRF05.SchDoc]

### Parts
C52  value 1nF  [c-0805]  (hidden comment: 102)
C53  value 100nF  [c-0805]  (hidden comment: 104)
C54  value 100nF  [c-0805]  (hidden comment: 104)
P55  value SRF05 IO  [HDR2X5]  (hidden comment: Header 5X2)
P56  Publisher: Power Terminal  [HDR2X4]  (hidden comment: Header 4X2)
R200  value 5K6  [R-0805]  (hidden comment: 562)
S36  SW-SPDT  [SW-DIP1SMD]
U29  HY-SRF05  [SRF-05]
U30  NE555D  [DIP8]
VR2  50K  [VR1]

### Nets
+5V: S36.2 S36.3
GND: C52.1 C53.1 C54.1 P56.5 P56.6 P56.7 P56.8 U29.5(GND) U30.1(GND)
V-SRF05: C54.2 P56.1 P56.2 P56.3 P56.4 R200.2 S36.1 U29.1(VCC) U30.4(RST) U30.8(VCC)
ECHO: P55.5 P55.6 U29.2(ECHO)
SYNC: P55.1 P55.2 U30.3(OUT)
TRIG: P55.9 P55.10 U29.3(TRIGGER)
NetC52_2: C52.2 U30.2(TRIG) U30.6(THR) VR2.1(TOP) VR2.2(TAP)
NetC53_2: C53.2 U30.5(CVOLT)
NetR200_1: R200.1 U30.7(DISC) VR2.3(BOT)

Not connected (* = marked no-connect by the designer): P55 3 4 7 8; U29 4(NC)*

### Library data of the parts
C52-C54 = Cap: Capacitor; Published: 8-Jun-2000; LatestRevisionDate: 17-Jul-2002; LatestRevisionNote: Re-released for DXP Platform.; PackageReference: RAD-0.3; Publisher: Altium Limited
P55 = Header 5X2: Header, 5-Pin, Dual row; LatestRevisionDate: 17-Jul-2002; LatestRevisionNote: Re-released for DXP Platform.
P56 = Header 4X2: Header, 4-Pin, Dual row; LatestRevisionDate: 17-Jul-2002; LatestRevisionNote: Re-released for DXP Platform.
R200 = Res1: Resistor; Published: 8-Jun-2000; LatestRevisionDate: 17-Jul-2002; LatestRevisionNote: Re-released for DXP Platform.; PackageReference: AXIAL-0.3; Publisher: Altium Limited
S36 = SW-SPDT: as S35 on sheet 14-Counter74LS192; Published: 24-Mar-1999; LatestRevisionDate: 17-Dec-2003; LatestRevisionNote: Schematic revised, PCB Footprint replaced.; DatasheetVersion: 05-Dec-2000; PackageReference: TL36WW15050; Publisher: Altium Limited; PackageDescription: Switch; 4 Leads; ComponentLink1Description: Manufacturer Link; ComponentLink1URL: http://www.apem.com
U30 = NE555D: General-Purpose Single Bipolar Timer; Published: 24-Aug-2001; LatestRevisionDate: 13-Apr-2006; LatestRevisionNote: IPC-7351 Footprint Added.; DatasheetVersion: Jul-1998; PackageVersion: Dec-2002; PackageReference: SO8; Publisher: Altium Limited; PackageDescription: 8-Pin Small Outline Integrated Circuit 1.27 mm Pitch; Code_JEDEC: MS-012-AA; Code_IPC: SOIC127P600-8; ComponentLink1Description: Manufacturer Link; ComponentLink1URL: http://www.st.com/; ComponentLink2Description: Datasheet; ComponentLink2URL: http://www.st.com/stonline/products/literature/ds/2182/ne555.pdf
VR2 = RPot: Potentiometer; Sim Note: Enter the Resistance value and the set point into parameter fields.; Set Position: 0.5; Published: 8-Jun-2000; LatestRevisionDate: 17-Jul-2002; LatestRevisionNote: Re-released for DXP Platform.; PackageReference: VR5; Publisher: Altium Limited; Value: 50K

## Sheet 16-BitSW.SchDoc
size A4
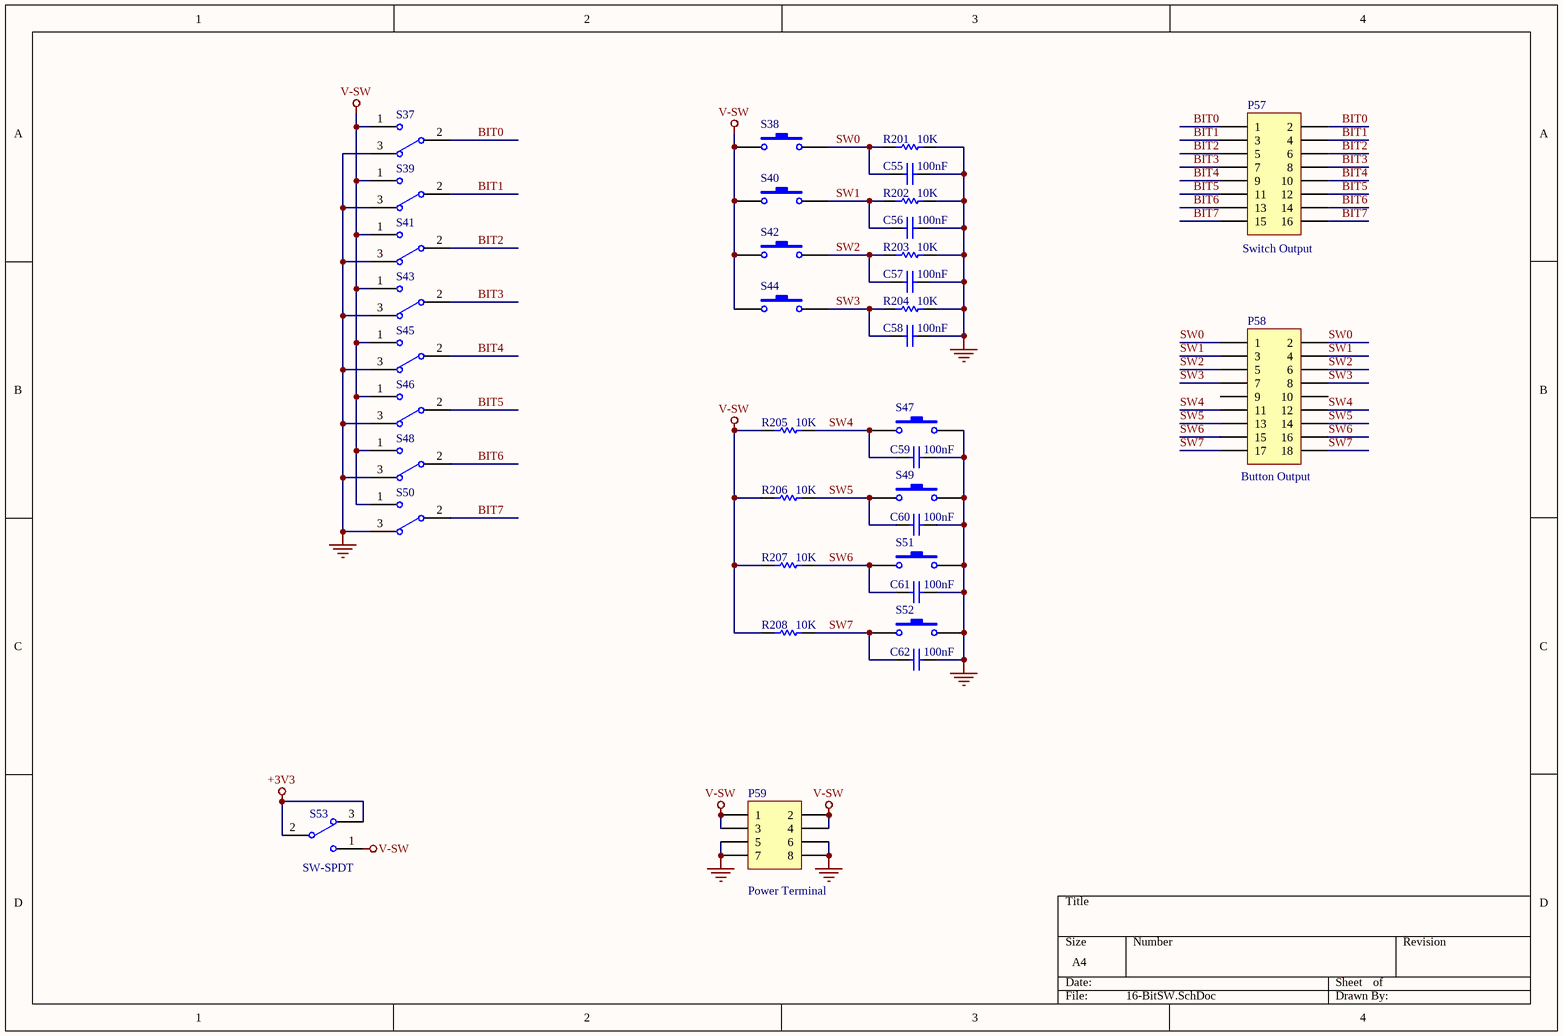
[diagram p22: 16-BitSW.SchDoc]

### Parts
C55  value 100nF  [C-0805]  (hidden comment: 104)
C56  value 100nF  [C-0805]  (hidden comment: 104)
C57  value 100nF  [C-0805]  (hidden comment: 104)
C58  value 100nF  [C-0805]  (hidden comment: 104)
C59  value 100nF  [C-0805]  (hidden comment: 104)
C60  value 100nF  [C-0805]  (hidden comment: 104)
C61  value 100nF  [C-0805]  (hidden comment: 104)
C62  value 100nF  [C-0805]  (hidden comment: 104)
P57  value Switch Output  [HDR2X8]  (hidden comment: Header 8X2)
P58  value Button Output  [HDR2X9]  (hidden comment: Header 9X2)
P59  Publisher: Power Terminal  [HDR2X4]  (hidden comment: Header 4X2)
R201  10K  [r-0805]
R202  10K  [r-0805]
R203  10K  [r-0805]
R204  10K  [r-0805]
R205  10K  [r-0805]
R206  10K  [r-0805]
R207  10K  [r-0805]
R208  10K  [r-0805]
S37  SW-SPDT  [SW-DIP1SMD]  (value not drawn)
S38  SW2  [sw2]  (value not drawn)
S39  SW-SPDT  [SW-DIP1SMD]  (value not drawn)
S40  SW2  [sw2]  (value not drawn)
S41  SW-SPDT  [SW-DIP1SMD]  (value not drawn)
S42  SW2  [sw2]  (value not drawn)
S43  SW-SPDT  [SW-DIP1SMD]  (value not drawn)
S44  SW2  [sw2]  (value not drawn)
S45  SW-SPDT  [SW-DIP1SMD]  (value not drawn)
S46  SW-SPDT  [SW-DIP1SMD]  (value not drawn)
S47  SW2  [sw2]  (value not drawn)
S48  SW-SPDT  [SW-DIP1SMD]  (value not drawn)
S49  SW2  [sw2]  (value not drawn)
S50  SW-SPDT  [SW-DIP1SMD]  (value not drawn)
S51  SW2  [sw2]  (value not drawn)
S52  SW2  [sw2]  (value not drawn)
S53  SW-SPDT  [SW-DIP1SMD]

### Nets
+3V3: S53.2 S53.3
GND: C55.1 C56.1 C57.1 C58.1 C59.1 C60.1 C61.1 C62.1 P59.5 P59.6 P59.7 P59.8 R201.1 R202.1 R203.1 R204.1 S37.3 S39.3 S41.3 S43.3 S45.3 S46.3 S47.2 S48.3 S49.2 S50.3 S51.2 S52.2
V-SW: P59.1 P59.2 P59.3 P59.4 R205.2 R206.2 R207.2 R208.2 S37.1 S38.1 S39.1 S40.1 S41.1 S42.1 S43.1 S44.1 S45.1 S46.1 S48.1 S50.1 S53.1
BIT0: P57.1 P57.2 S37.2
BIT1: P57.3 P57.4 S39.2
BIT2: P57.5 P57.6 S41.2
BIT3: P57.7 P57.8 S43.2
BIT4: P57.9 P57.10 S45.2
BIT5: P57.11 P57.12 S46.2
BIT6: P57.13 P57.14 S48.2
BIT7: P57.15 P57.16 S50.2
SW0: C55.2 P58.1 P58.2 R201.2 S38.2
SW1: C56.2 P58.3 P58.4 R202.2 S40.2
SW2: C57.2 P58.5 P58.6 R203.2 S42.2
SW3: C58.2 P58.7 P58.8 R204.2 S44.2
SW4: C59.2 P58.11 P58.12 R205.1 S47.1
SW5: C60.2 P58.13 P58.14 R206.1 S49.1
SW6: C61.2 P58.15 P58.16 R207.1 S51.1
SW7: C62.2 P58.17 P58.18 R208.1 S52.1

Not connected (* = marked no-connect by the designer): P58 9 10

### Library data of the parts
C55-C62 = Cap: Capacitor; Manufacturer: Generic Components; Class: Passive; Published: 08/06/2000; Publisher: Altium Hobart Technology Centre; SubClass: Capacitor
P57 = Header 8X2: Header, 8-Pin, Dual row; LatestRevisionDate: 17-Jul-2002; LatestRevisionNote: Re-released for DXP Platform.
P58 = Header 9X2: Header, 9-Pin, Dual row; LatestRevisionDate: 17-Jul-2002; LatestRevisionNote: Re-released for DXP Platform.
P59 = Header 4X2: Header, 4-Pin, Dual row; LatestRevisionDate: 17-Jul-2002; LatestRevisionNote: Re-released for DXP Platform.
R201-R208 = Res1: Resistor; Published: 8-Jun-2000; LatestRevisionDate: 17-Jul-2002; LatestRevisionNote: Re-released for DXP Platform.; PackageReference: AXIAL-0.3; Publisher: Altium Limited; PackageDescription: Axial Device, Thru-Hole; 2 Leads; 0.3 in Pin Spacing; Value: 10K
S37 S39 S41 S43 S45 S46 S48 S50 S53 = SW-SPDT: as S35 on sheet 14-Counter74LS192; Published: 24-Mar-1999; LatestRevisionDate: 17-Dec-2003; LatestRevisionNote: Schematic revised, PCB Footprint replaced.; DatasheetVersion: 05-Dec-2000; PackageReference: TL36WW15050; Publisher: Altium Limited; PackageDescription: Switch; 4 Leads; ComponentLink1Description: Manufacturer Link; ComponentLink1URL: http://www.apem.com
S38 S40 S42 S44 S47 S49 S51 S52 = SW-PB: Switch; Published: 24-Mar-1999; LatestRevisionDate: 17-Jul-2002; LatestRevisionNote: Re-released for DXP Platform.; PackageReference: SPST-2; Publisher: Altium Limited

## Sheet 16-BitSWStatusLed.SchDoc
size A4
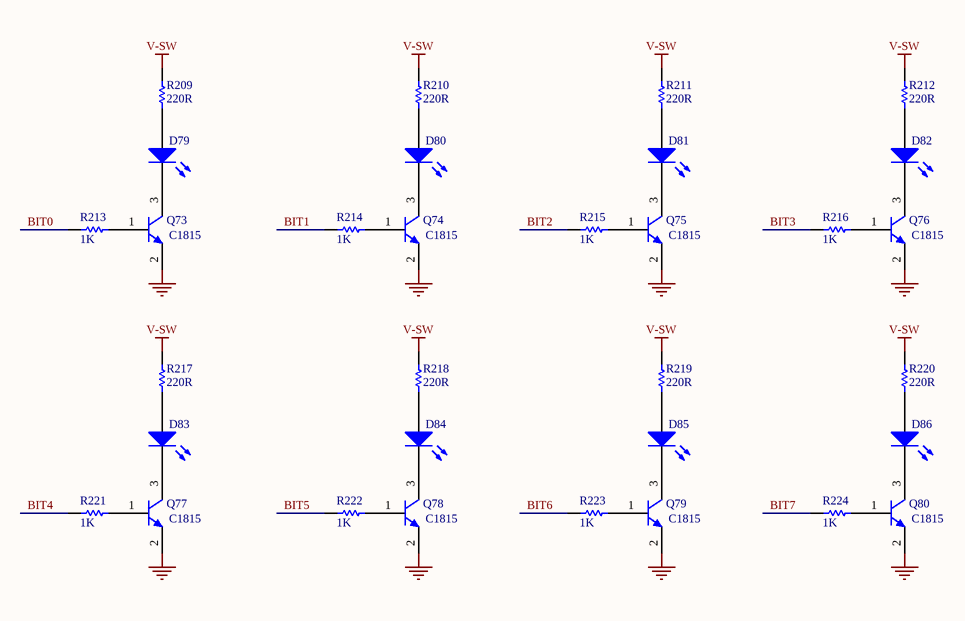
[diagram p23: 16-BitSWStatusLed.SchDoc]

### Parts
D79  LED  [LED-3528]  (value not drawn)
D80  LED  [LED-3528]  (value not drawn)
D81  LED  [LED-3528]  (value not drawn)
D82  LED  [LED-3528]  (value not drawn)
D83  LED  [LED-3528]  (value not drawn)
D84  LED  [LED-3528]  (value not drawn)
D85  LED  [LED-3528]  (value not drawn)
D86  LED  [LED-3528]  (value not drawn)
Q73  value C1815  [SOT23-321]  (hidden comment: C1815-SMD)
Q74  value C1815  [SOT23-321]  (hidden comment: C1815-SMD)
Q75  value C1815  [SOT23-321]  (hidden comment: C1815-SMD)
Q76  value C1815  [SOT23-321]  (hidden comment: C1815-SMD)
Q77  value C1815  [SOT23-321]  (hidden comment: C1815-SMD)
Q78  value C1815  [SOT23-321]  (hidden comment: C1815-SMD)
Q79  value C1815  [SOT23-321]  (hidden comment: C1815-SMD)
Q80  value C1815  [SOT23-321]  (hidden comment: C1815-SMD)
R209  value 220R  [R-0805]  (hidden comment: 221)
R210  value 220R  [R-0805]  (hidden comment: 221)
R211  value 220R  [R-0805]  (hidden comment: 221)
R212  value 220R  [R-0805]  (hidden comment: 221)
R213  1K  [R-0805]
R214  1K  [R-0805]
R215  1K  [R-0805]
R216  1K  [R-0805]
R217  value 220R  [R-0805]  (hidden comment: 221)
R218  value 220R  [R-0805]  (hidden comment: 221)
R219  value 220R  [R-0805]  (hidden comment: 221)
R220  value 220R  [R-0805]  (hidden comment: 221)
R221  1K  [R-0805]
R222  1K  [R-0805]
R223  1K  [R-0805]
R224  1K  [R-0805]

### Nets
GND: Q73.2(E) Q74.2(E) Q75.2(E) Q76.2(E) Q77.2(E) Q78.2(E) Q79.2(E) Q80.2(E)
V-SW: R209.2 R210.2 R211.2 R212.2 R217.2 R218.2 R219.2 R220.2
BIT0: R213.2
BIT1: R214.2
BIT2: R215.2
BIT3: R216.2
BIT4: R221.2
BIT5: R222.2
BIT6: R223.2
BIT7: R224.2
NetD79_1: D79.1(A) R209.1
NetD79_2: D79.2(K) Q73.3(C)
NetD80_1: D80.1(A) R210.1
NetD80_2: D80.2(K) Q74.3(C)
NetD81_1: D81.1(A) R211.1
NetD81_2: D81.2(K) Q75.3(C)
NetD82_1: D82.1(A) R212.1
NetD82_2: D82.2(K) Q76.3(C)
NetD83_1: D83.1(A) R217.1
NetD83_2: D83.2(K) Q77.3(C)
NetD84_1: D84.1(A) R218.1
NetD84_2: D84.2(K) Q78.3(C)
NetD85_1: D85.1(A) R219.1
NetD85_2: D85.2(K) Q79.3(C)
NetD86_1: D86.1(A) R220.1
NetD86_2: D86.2(K) Q80.3(C)
NetQ73_1: Q73.1(B) R213.1
NetQ74_1: Q74.1(B) R214.1
NetQ75_1: Q75.1(B) R215.1
NetQ76_1: Q76.1(B) R216.1
NetQ77_1: Q77.1(B) R221.1
NetQ78_1: Q78.1(B) R222.1
NetQ79_1: Q79.1(B) R223.1
NetQ80_1: Q80.1(B) R224.1

### Library data of the parts
D79-D86 = LED2: Typical RED, GREEN, YELLOW, AMBER GaAs LED; Published: 8-Jun-2000; LatestRevisionDate: 17-Jul-2002; LatestRevisionNote: Re-released for DXP Platform.; PackageVersion: Feb-2002; PackageReference: 3.2X1.6X1.1; Publisher: Altium Limited; PackageDescription: SM LED; 2 Flat Leads
Q73-Q80 = NPN: NPN Bipolar Transistor; Published: 8-Jun-2000; LatestRevisionDate: 17-Jul-2002; LatestRevisionNote: Re-released for DXP Platform.; PackageReference: TO-226-AA; PackageDescription: TO, Flat Index; 3 In-Line, Axial Leads; Body Dia. 4.8mm; Leads 0.55 x 0.51 mm (max); Code_JEDEC: TO-226-AA
R209-R224 = Res1: Resistor; Published: 8-Jun-2000; LatestRevisionDate: 17-Jul-2002; LatestRevisionNote: Re-released for DXP Platform.; PackageReference: AXIAL-0.3; Publisher: Altium Limited; PackageDescription: Axial Device, Thru-Hole; 2 Leads; 0.3 in Pin Spacing
  R213-R216 R221-R224: Value: 1K

## Sheet 17-Led.SchDoc
size A4
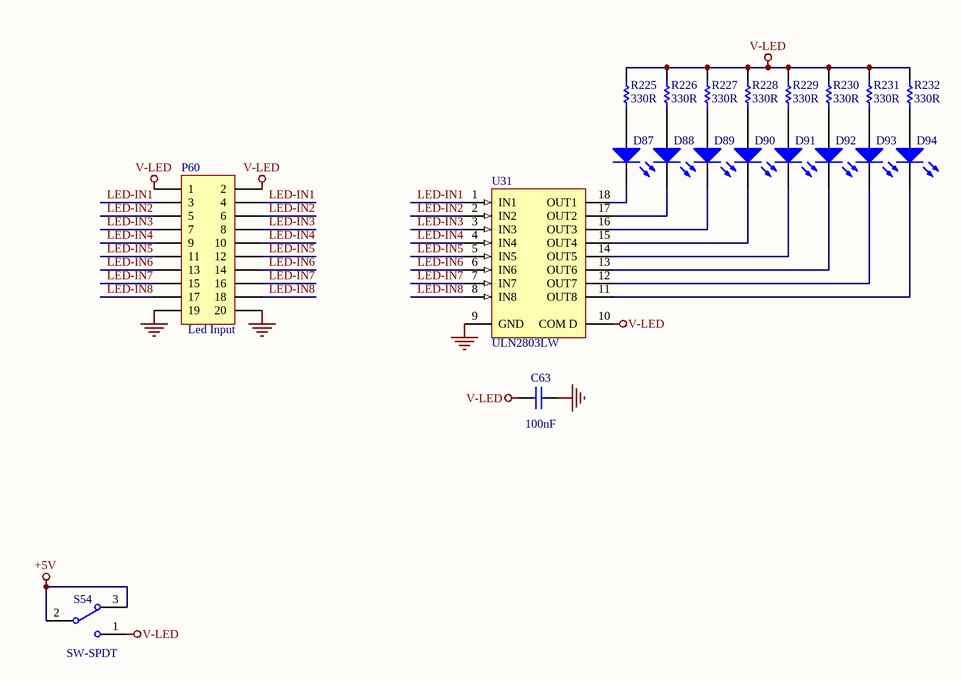
[diagram p24: 17-Led.SchDoc]

### Parts
C63  value 100nF  [C-0805]  (hidden comment: 104)
D87  LED  [LED-3528]  (value not drawn)
D88  LED  [LED-3528]  (value not drawn)
D89  LED  [LED-3528]  (value not drawn)
D90  LED  [LED-3528]  (value not drawn)
D91  LED  [LED-3528]  (value not drawn)
D92  LED  [LED-3528]  (value not drawn)
D93  LED  [LED-3528]  (value not drawn)
D94  LED  [LED-3528]  (value not drawn)
P60  value Led Input  [HDR2X10]  (hidden comment: H10X2)
R225  330R  [R-0805]
R226  330R  [R-0805]
R227  330R  [R-0805]
R228  330R  [R-0805]
R229  330R  [R-0805]
R230  330R  [R-0805]
R231  330R  [R-0805]
R232  330R  [R-0805]
S54  SW-SPDT  [SW-DIP1SMD]
U31  ULN2803LW  [sop-18]

### Nets
+5V: S54.2 S54.3
GND: C63.2 P60.19 P60.20 U31.9(GND)
V-LED: C63.1 P60.1 P60.2 R225.2 R226.2 R227.2 R228.2 R229.2 R230.2 R231.2 R232.2 S54.1 U31.10(COM_D)
LED-IN1: P60.3 P60.4 U31.1(IN1)
LED-IN2: P60.5 P60.6 U31.2(IN2)
LED-IN3: P60.7 P60.8 U31.3(IN3)
LED-IN4: P60.9 P60.10 U31.4(IN4)
LED-IN5: P60.11 P60.12 U31.5(IN5)
LED-IN6: P60.13 P60.14 U31.6(IN6)
LED-IN7: P60.15 P60.16 U31.7(IN7)
LED-IN8: P60.17 P60.18 U31.8(IN8)
NetD87_1: D87.1(A) R225.1
NetD87_2: D87.2(K) U31.18(OUT1)
NetD88_1: D88.1(A) R226.1
NetD88_2: D88.2(K) U31.17(OUT2)
NetD89_1: D89.1(A) R227.1
NetD89_2: D89.2(K) U31.16(OUT3)
NetD90_1: D90.1(A) R228.1
NetD90_2: D90.2(K) U31.15(OUT4)
NetD91_1: D91.1(A) R229.1
NetD91_2: D91.2(K) U31.14(OUT5)
NetD92_1: D92.1(A) R230.1
NetD92_2: D92.2(K) U31.13(OUT6)
NetD93_1: D93.1(A) R231.1
NetD93_2: D93.2(K) U31.12(OUT7)
NetD94_1: D94.1(A) R232.1
NetD94_2: D94.2(K) U31.11(OUT8)

### Library data of the parts
C63 = Cap: Capacitor; Published: 8-Jun-2000; LatestRevisionDate: 17-Jul-2002; LatestRevisionNote: Re-released for DXP Platform.; PackageReference: RAD-0.3; Publisher: Altium Limited; PackageDescription: Radial Cap, Thru-Hole; 2 Leads; 0.3 in Pin Spacing
D87-D94 = LED2: as D79-D86 on sheet 16-BitSWStatusLed; Published: 8-Jun-2000; LatestRevisionDate: 17-Jul-2002; LatestRevisionNote: Re-released for DXP Platform.; PackageVersion: Feb-2002; PackageReference: 3.2X1.6X1.1; Publisher: Altium Limited; PackageDescription: SM LED; 2 Flat Leads
P60 = Header 10X2: Header, 10-Pin, Dual row; LatestRevisionDate: 17-Jul-2002; LatestRevisionNote: Re-released for DXP Platform.
R225-R232 = Res1: Resistor; Published: 8-Jun-2000; LatestRevisionDate: 17-Jul-2002; LatestRevisionNote: Re-released for DXP Platform.; PackageReference: AXIAL-0.3; Publisher: Altium Limited; PackageDescription: Axial Device, Thru-Hole; 2 Leads; 0.3 in Pin Spacing; Value: 330R
S54 = SW-SPDT: as S35 on sheet 14-Counter74LS192; Published: 24-Mar-1999; LatestRevisionDate: 17-Dec-2003; LatestRevisionNote: Schematic revised, PCB Footprint replaced.; DatasheetVersion: 05-Dec-2000; PackageReference: TL36WW15050; Publisher: Altium Limited; PackageDescription: Switch; 4 Leads; ComponentLink1Description: Manufacturer Link; ComponentLink1URL: http://www.apem.com
U31 = ULN2803LW: High-Voltage, High-Current Darlington Array; Published: 13-Oct-2000; LatestRevisionDate: 13-Apr-2006; LatestRevisionNote: IPC-7351 Footprint Added.; DatasheetVersion: 1999; PackageReference: LW18; Publisher: Altium Limited; PackageDescription: 18-Pin Small Outline Integrated Circuit 1.27 mm Pitch; Code_JEDEC: MS-013-AB; ComponentLink1Description: Manufacturer Link; ComponentLink1URL: http://www.allegromicro.com/